# EAGLE schematic oresat0-1u-backplane (EAGLE 9.6.2)

## Sheet 1 of 9: Slot 1
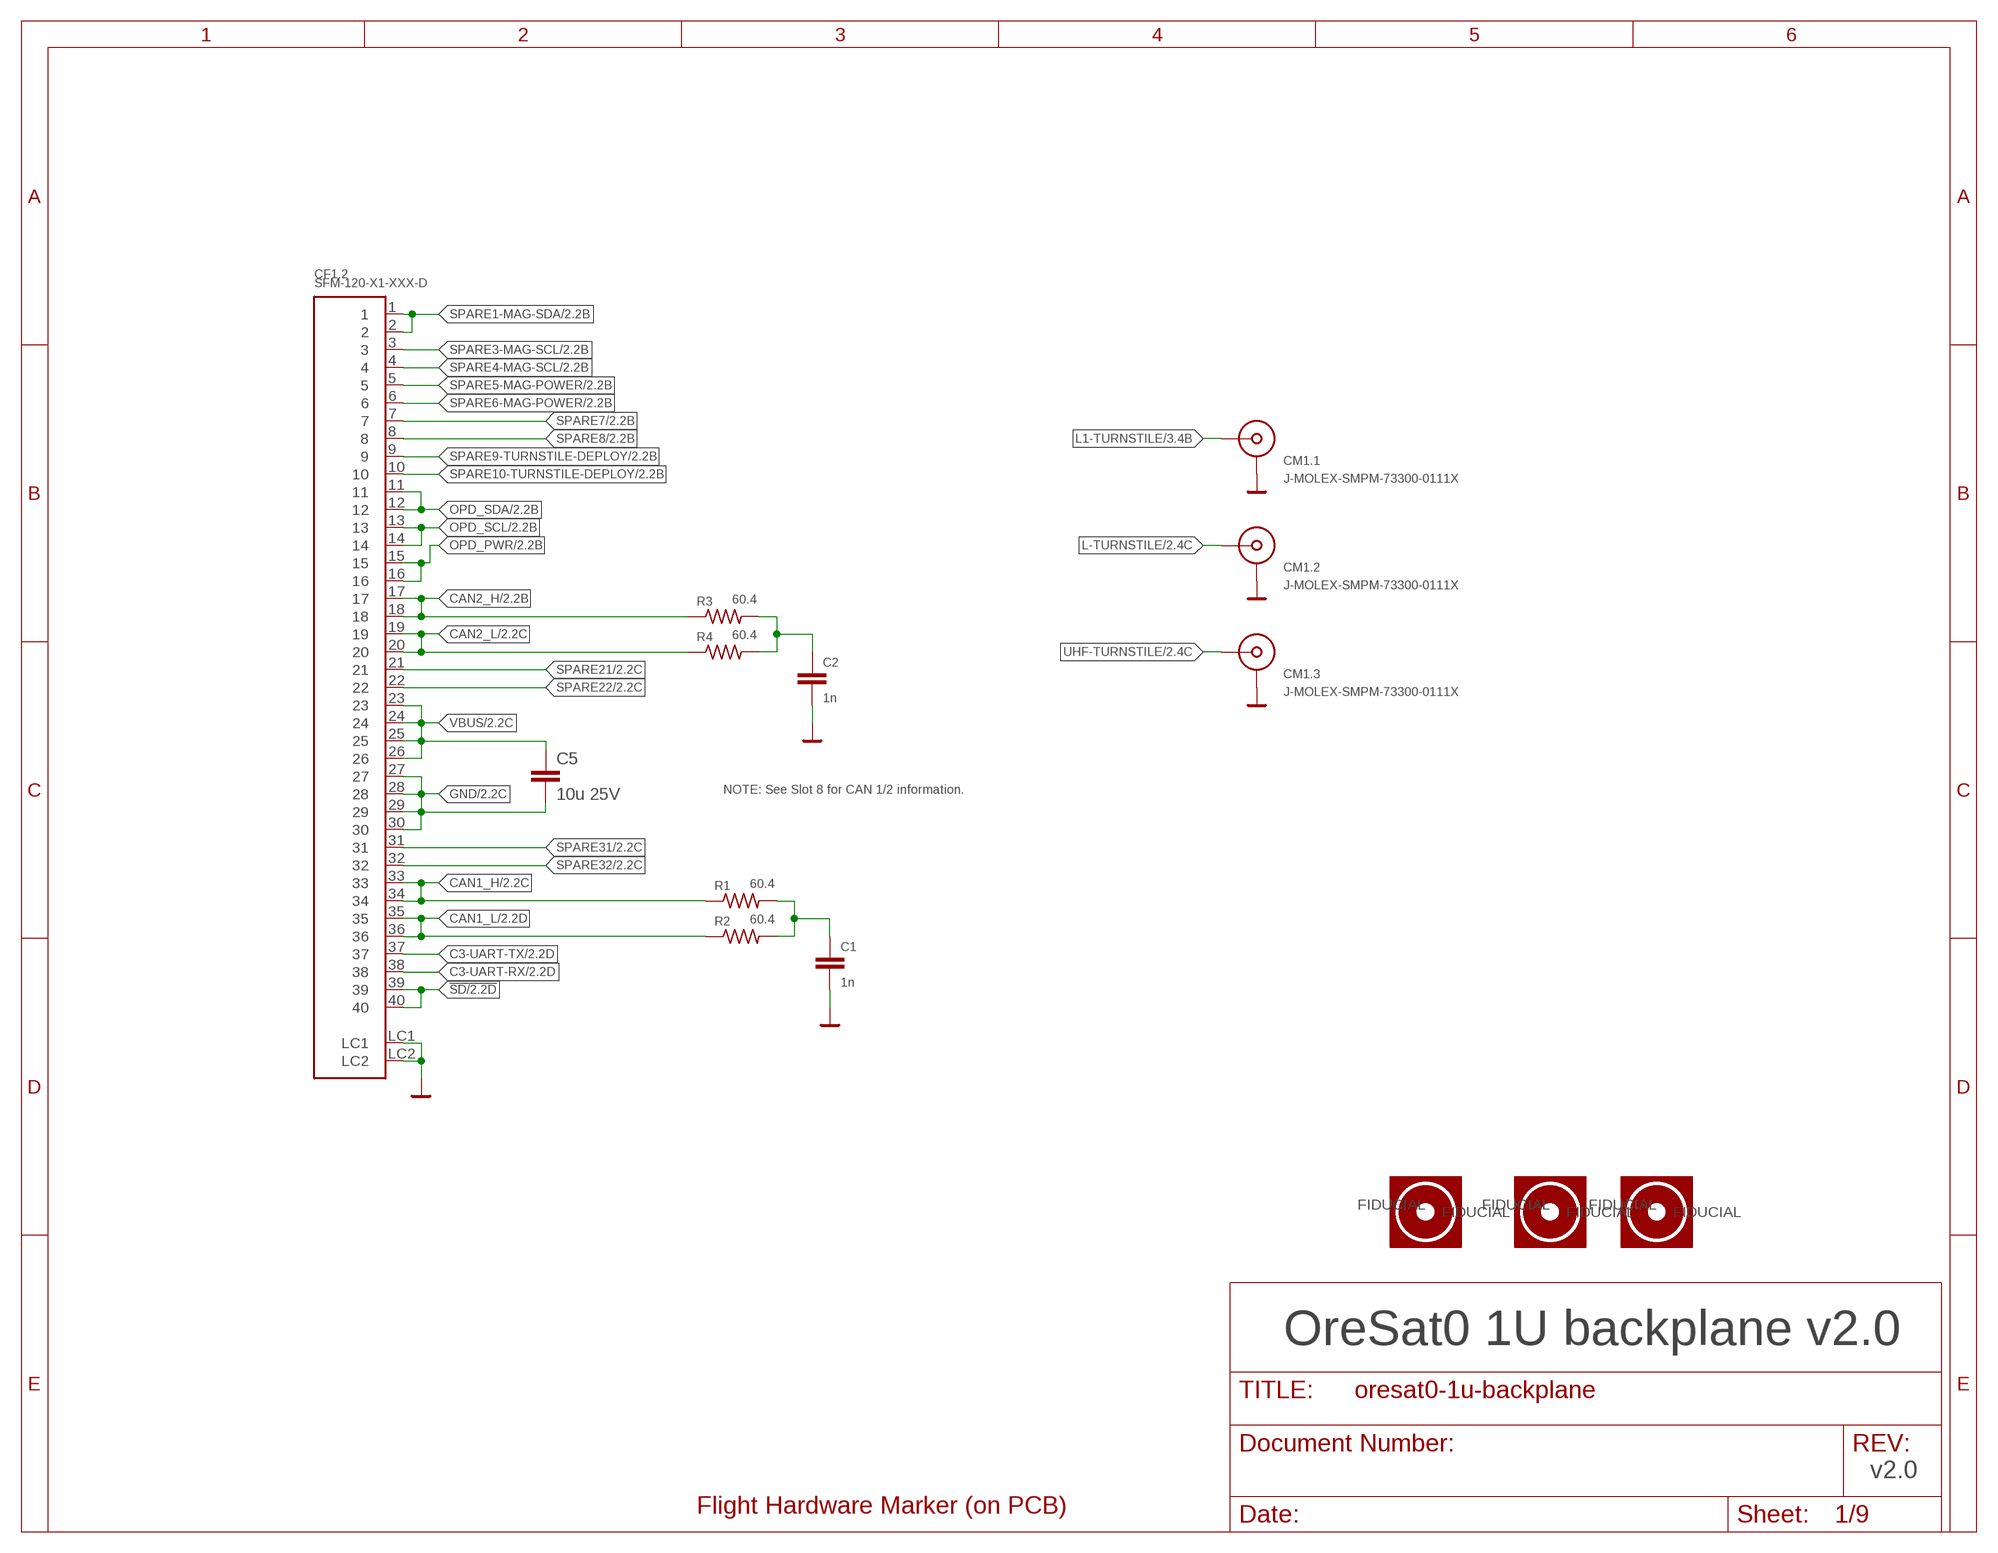
[diagram p0: schematic, sheet 1]

### Parts
C1  1n  C-EU0603-C-NOSILK  [.0603-C-NOSILK]
C2  1n  C-EU0603-C-NOSILK  [.0603-C-NOSILK]
C5  10u 25V  C-EU1206-B  [1206-B]
CF1.2  SFM-120-X1-XXX-D  [SFM-120-X1-XXX-D]
CM1.1  J-MOLEX-SMPM-73300-0111X  [J-MOLEX-SMPM-73300-0111X]
CM1.2  J-MOLEX-SMPM-73300-0111X  [J-MOLEX-SMPM-73300-0111X]
CM1.3  J-MOLEX-SMPM-73300-0111X  [J-MOLEX-SMPM-73300-0111X]
FIDUCIAL1  FIDUCIAL-1.0X2.0  [FIDUCIAL-1.0X2.0]
FIDUCIAL2  FIDUCIAL-1.0X2.0  [FIDUCIAL-1.0X2.0]
FIDUCIAL3  FIDUCIAL-1.0X2.0  [FIDUCIAL-1.0X2.0]
R1  60.4  R-US_1206-C  [1206-C]
R2  60.4  R-US_1206-C  [1206-C]
R3  60.4  R-US_1206-C  [1206-C]
R4  60.4  R-US_1206-C  [1206-C]
U$1  FLIGHMARKERNEW  [FLIGHTMARKER_NEW_BOARDS]

### Nets
!SD [SHUTDOWN]: CF1.2.39 CF1.2.40 ; also sheet 2,3,4,5,6,7
C3-UART-RX: CF1.2.38 ; also sheet 2,3,4,5,6,7
C3-UART-TX: CF1.2.37 ; also sheet 2,3,4,5,6,7
CAN1_H: CF1.2.33 CF1.2.34 R1.1 ; also sheet 2,3,4,5,6,7,8
CAN1_L: CF1.2.35 CF1.2.36 R2.1 ; also sheet 2,3,4,5,6,7,8
CAN2_H: CF1.2.17 CF1.2.18 R3.1 ; also sheet 2,3,4,5,6,7,8
CAN2_L: CF1.2.19 CF1.2.20 R4.1 ; also sheet 2,3,4,5,6,7,8
GND: C1.2 C2.2 C5.2 CF1.2.27 CF1.2.28 CF1.2.29 CF1.2.30 CF1.2.LC1 CF1.2.LC2 CM1.1.P$1(SHIELD1) CM1.1.P$2(SHIELD1) CM1.1.P$3(SHIELD1) CM1.1.P$4(SHIELD1) CM1.2.P$1(SHIELD1) CM1.2.P$2(SHIELD1) CM1.2.P$3(SHIELD1) CM1.2.P$4(SHIELD1) CM1.3.P$1(SHIELD1) CM1.3.P$2(SHIELD1) CM1.3.P$3(SHIELD1) CM1.3.P$4(SHIELD1) ; also sheet 2,3,4,5,6,7,8,9
L1-TURNSTILE [RF]: CM1.1.RF-DOWN(RF) ; also sheet 3
L-TURNSTILE [RF]: CM1.2.RF-DOWN(RF) ; also sheet 2
N$1: C2.1 R3.2 R4.2
N$2: C1.1 R1.2 R2.2
OPD_PWR: CF1.2.15 CF1.2.16 ; also sheet 2,3,4,5,6,7
OPD_SCL: CF1.2.13 CF1.2.14 ; also sheet 2,3,4,5,6,7
OPD_SDA: CF1.2.11 CF1.2.12 ; also sheet 2,3,4,5,6,7
SPARE1-MAG-SDA: CF1.2.1 CF1.2.2 ; also sheet 2,3,4,5,6,7,9
SPARE3-MAG-SCL: CF1.2.3 ; also sheet 2,3,4,5,6,7,9
SPARE4-MAG-SCL: CF1.2.4 ; also sheet 2,3,4,5,6,7,9
SPARE5-MAG-POWER: CF1.2.5 ; also sheet 2,3,4,5,6,7,9
SPARE6-MAG-POWER: CF1.2.6 ; also sheet 2,3,4,5,6,7,9
SPARE7: CF1.2.7 ; also sheet 2,3,4,5,6,7,9
SPARE8: CF1.2.8 ; also sheet 2,3,4,5,6,7,9
SPARE9-TURNSTILE-DEPLOY: CF1.2.9 ; also sheet 2,3,4,5,6,7,9
SPARE10-TURNSTILE-DEPLOY: CF1.2.10 ; also sheet 2,3,4,5,6,7,9
SPARE21: CF1.2.21 ; also sheet 2,3,4,5,6,7
SPARE22: CF1.2.22 ; also sheet 2,3,4,5,6,7
SPARE31: CF1.2.31 ; also sheet 2,3,4,5,6,7
SPARE32: CF1.2.32 ; also sheet 2,3,4,5,6,7
UHF-TURNSTILE [RF]: CM1.3.RF-DOWN(RF) ; also sheet 2
VBUS: C5.1 CF1.2.23 CF1.2.24 CF1.2.25 CF1.2.26 ; also sheet 2,3,4,5,6,7
Unconnected: FIDUCIAL1.FIDUCIAL FIDUCIAL2.FIDUCIAL FIDUCIAL3.FIDUCIAL

### Notes on the sheet
- NOTE: See Slot 8 for CAN 1/2 information.
- OreSat0 1U backplane v2.0
- v2.0

## Sheet 2 of 9: Slot 2
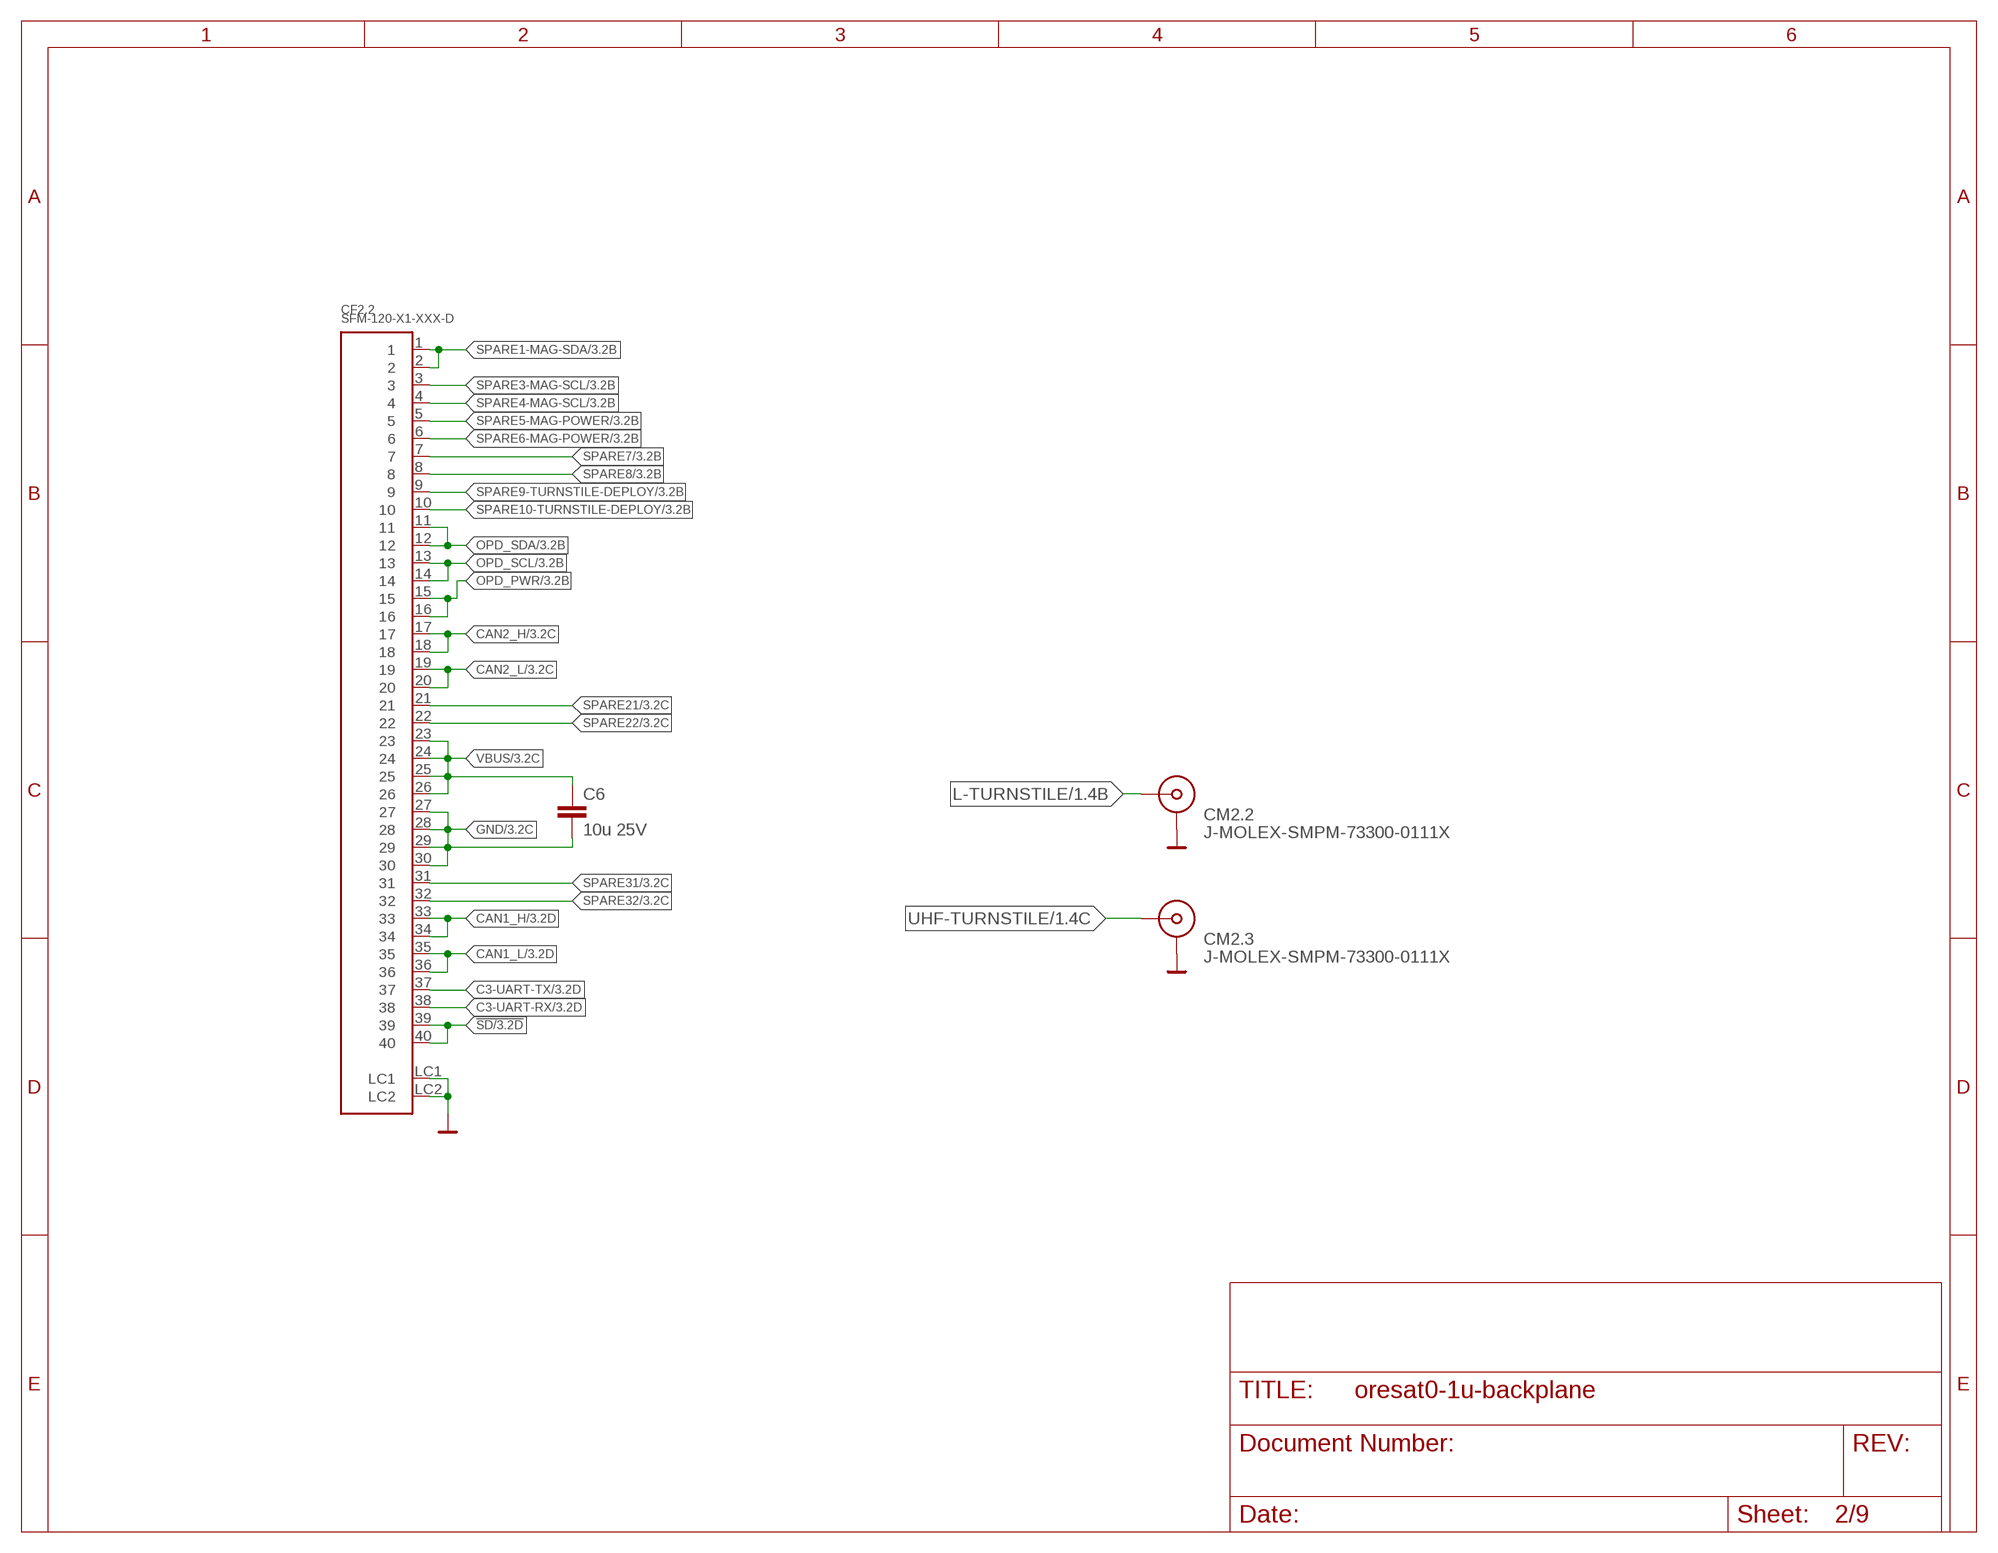
[diagram p1: schematic, sheet 2]

### Parts
C6  10u 25V  C-EU1206-B  [1206-B]
CF2.2  SFM-120-X1-XXX-D  [SFM-120-X1-XXX-D]
CM2.2  J-MOLEX-SMPM-73300-0111X  [J-MOLEX-SMPM-73300-0111X]
CM2.3  J-MOLEX-SMPM-73300-0111X  [J-MOLEX-SMPM-73300-0111X]

### Nets
!SD [SHUTDOWN]: CF2.2.39 CF2.2.40 ; also sheet 1,3,4,5,6,7
C3-UART-RX: CF2.2.38 ; also sheet 1,3,4,5,6,7
C3-UART-TX: CF2.2.37 ; also sheet 1,3,4,5,6,7
CAN1_H: CF2.2.33 CF2.2.34 ; also sheet 1,3,4,5,6,7,8
CAN1_L: CF2.2.35 CF2.2.36 ; also sheet 1,3,4,5,6,7,8
CAN2_H: CF2.2.17 CF2.2.18 ; also sheet 1,3,4,5,6,7,8
CAN2_L: CF2.2.19 CF2.2.20 ; also sheet 1,3,4,5,6,7,8
GND: C6.2 CF2.2.27 CF2.2.28 CF2.2.29 CF2.2.30 CF2.2.LC1 CF2.2.LC2 CM2.2.P$1(SHIELD1) CM2.2.P$2(SHIELD1) CM2.2.P$3(SHIELD1) CM2.2.P$4(SHIELD1) CM2.3.P$1(SHIELD1) CM2.3.P$2(SHIELD1) CM2.3.P$3(SHIELD1) CM2.3.P$4(SHIELD1) ; also sheet 1,3,4,5,6,7,8,9
L-TURNSTILE [RF]: CM2.2.RF-DOWN(RF) ; also sheet 1
OPD_PWR: CF2.2.15 CF2.2.16 ; also sheet 1,3,4,5,6,7
OPD_SCL: CF2.2.13 CF2.2.14 ; also sheet 1,3,4,5,6,7
OPD_SDA: CF2.2.11 CF2.2.12 ; also sheet 1,3,4,5,6,7
SPARE1-MAG-SDA: CF2.2.1 CF2.2.2 ; also sheet 1,3,4,5,6,7,9
SPARE3-MAG-SCL: CF2.2.3 ; also sheet 1,3,4,5,6,7,9
SPARE4-MAG-SCL: CF2.2.4 ; also sheet 1,3,4,5,6,7,9
SPARE5-MAG-POWER: CF2.2.5 ; also sheet 1,3,4,5,6,7,9
SPARE6-MAG-POWER: CF2.2.6 ; also sheet 1,3,4,5,6,7,9
SPARE7: CF2.2.7 ; also sheet 1,3,4,5,6,7,9
SPARE8: CF2.2.8 ; also sheet 1,3,4,5,6,7,9
SPARE9-TURNSTILE-DEPLOY: CF2.2.9 ; also sheet 1,3,4,5,6,7,9
SPARE10-TURNSTILE-DEPLOY: CF2.2.10 ; also sheet 1,3,4,5,6,7,9
SPARE21: CF2.2.21 ; also sheet 1,3,4,5,6,7
SPARE22: CF2.2.22 ; also sheet 1,3,4,5,6,7
SPARE31: CF2.2.31 ; also sheet 1,3,4,5,6,7
SPARE32: CF2.2.32 ; also sheet 1,3,4,5,6,7
UHF-TURNSTILE [RF]: CM2.3.RF-DOWN(RF) ; also sheet 1
VBUS: C6.1 CF2.2.23 CF2.2.24 CF2.2.25 CF2.2.26 ; also sheet 1,3,4,5,6,7

## Sheet 3 of 9: Slot 3
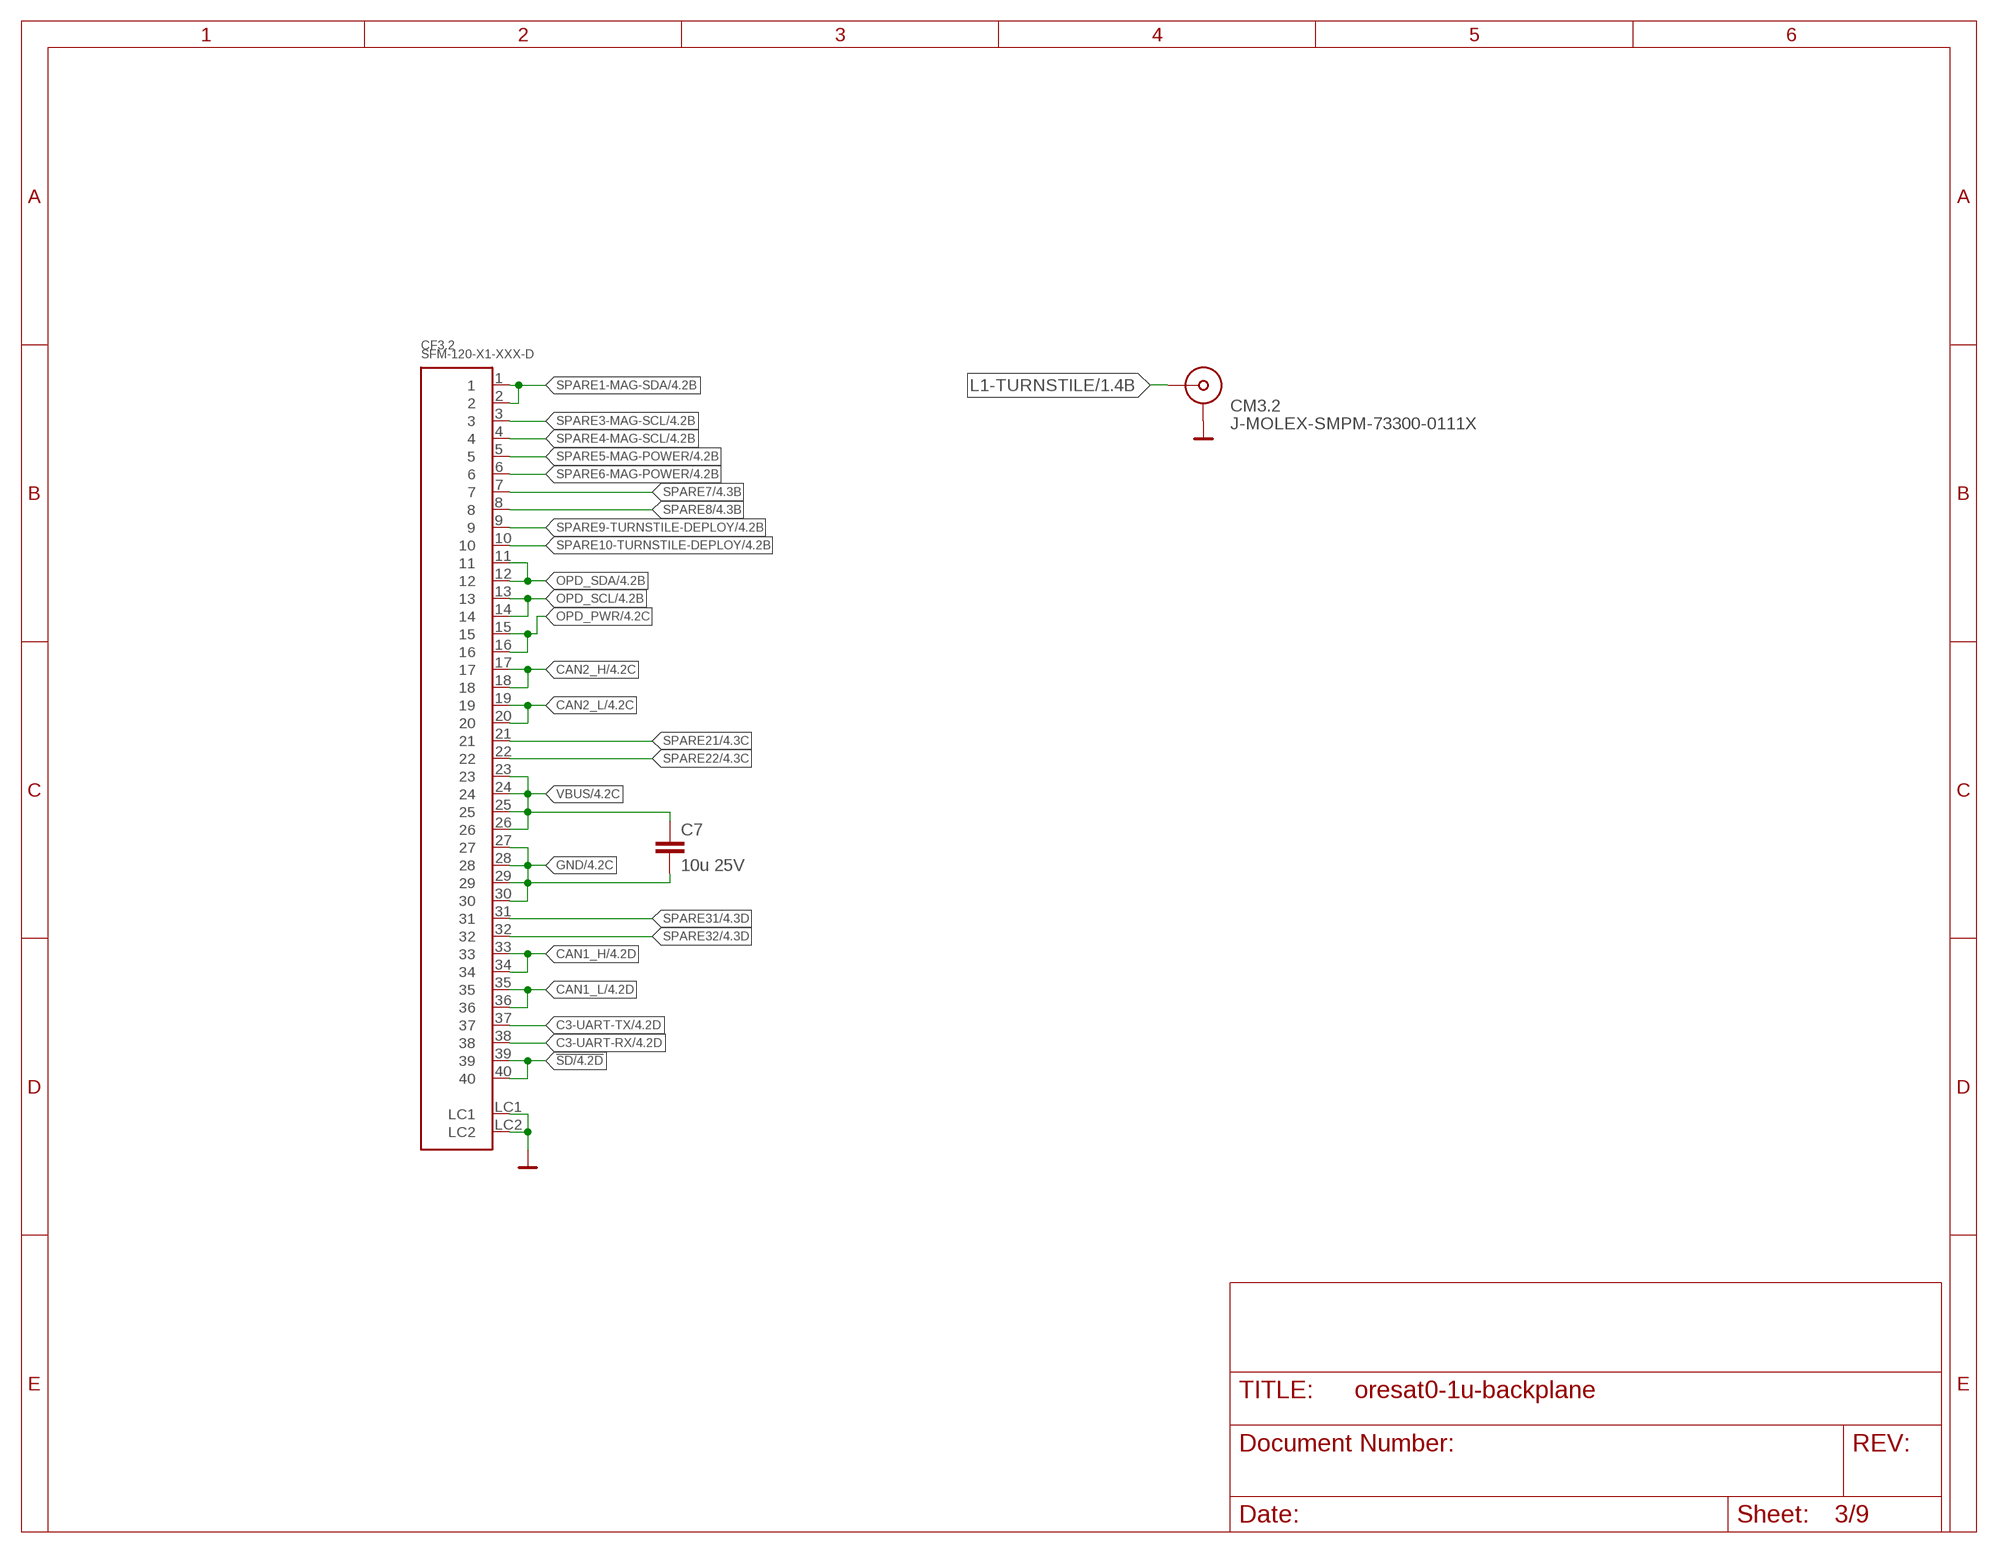
[diagram p2: schematic, sheet 3]

### Parts
C7  10u 25V  C-EU1206-B  [1206-B]
CF3.2  SFM-120-X1-XXX-D  [SFM-120-X1-XXX-D]
CM3.2  J-MOLEX-SMPM-73300-0111X  [J-MOLEX-SMPM-73300-0111X]

### Nets
!SD [SHUTDOWN]: CF3.2.39 CF3.2.40 ; also sheet 1,2,4,5,6,7
C3-UART-RX: CF3.2.38 ; also sheet 1,2,4,5,6,7
C3-UART-TX: CF3.2.37 ; also sheet 1,2,4,5,6,7
CAN1_H: CF3.2.33 CF3.2.34 ; also sheet 1,2,4,5,6,7,8
CAN1_L: CF3.2.35 CF3.2.36 ; also sheet 1,2,4,5,6,7,8
CAN2_H: CF3.2.17 CF3.2.18 ; also sheet 1,2,4,5,6,7,8
CAN2_L: CF3.2.19 CF3.2.20 ; also sheet 1,2,4,5,6,7,8
GND: C7.2 CF3.2.27 CF3.2.28 CF3.2.29 CF3.2.30 CF3.2.LC1 CF3.2.LC2 CM3.2.P$1(SHIELD1) CM3.2.P$2(SHIELD1) CM3.2.P$3(SHIELD1) CM3.2.P$4(SHIELD1) ; also sheet 1,2,4,5,6,7,8,9
L1-TURNSTILE [RF]: CM3.2.RF-DOWN(RF) ; also sheet 1
OPD_PWR: CF3.2.15 CF3.2.16 ; also sheet 1,2,4,5,6,7
OPD_SCL: CF3.2.13 CF3.2.14 ; also sheet 1,2,4,5,6,7
OPD_SDA: CF3.2.11 CF3.2.12 ; also sheet 1,2,4,5,6,7
SPARE1-MAG-SDA: CF3.2.1 CF3.2.2 ; also sheet 1,2,4,5,6,7,9
SPARE3-MAG-SCL: CF3.2.3 ; also sheet 1,2,4,5,6,7,9
SPARE4-MAG-SCL: CF3.2.4 ; also sheet 1,2,4,5,6,7,9
SPARE5-MAG-POWER: CF3.2.5 ; also sheet 1,2,4,5,6,7,9
SPARE6-MAG-POWER: CF3.2.6 ; also sheet 1,2,4,5,6,7,9
SPARE7: CF3.2.7 ; also sheet 1,2,4,5,6,7,9
SPARE8: CF3.2.8 ; also sheet 1,2,4,5,6,7,9
SPARE9-TURNSTILE-DEPLOY: CF3.2.9 ; also sheet 1,2,4,5,6,7,9
SPARE10-TURNSTILE-DEPLOY: CF3.2.10 ; also sheet 1,2,4,5,6,7,9
SPARE21: CF3.2.21 ; also sheet 1,2,4,5,6,7
SPARE22: CF3.2.22 ; also sheet 1,2,4,5,6,7
SPARE31: CF3.2.31 ; also sheet 1,2,4,5,6,7
SPARE32: CF3.2.32 ; also sheet 1,2,4,5,6,7
VBUS: C7.1 CF3.2.23 CF3.2.24 CF3.2.25 CF3.2.26 ; also sheet 1,2,4,5,6,7

## Sheet 4 of 9: Slot 4
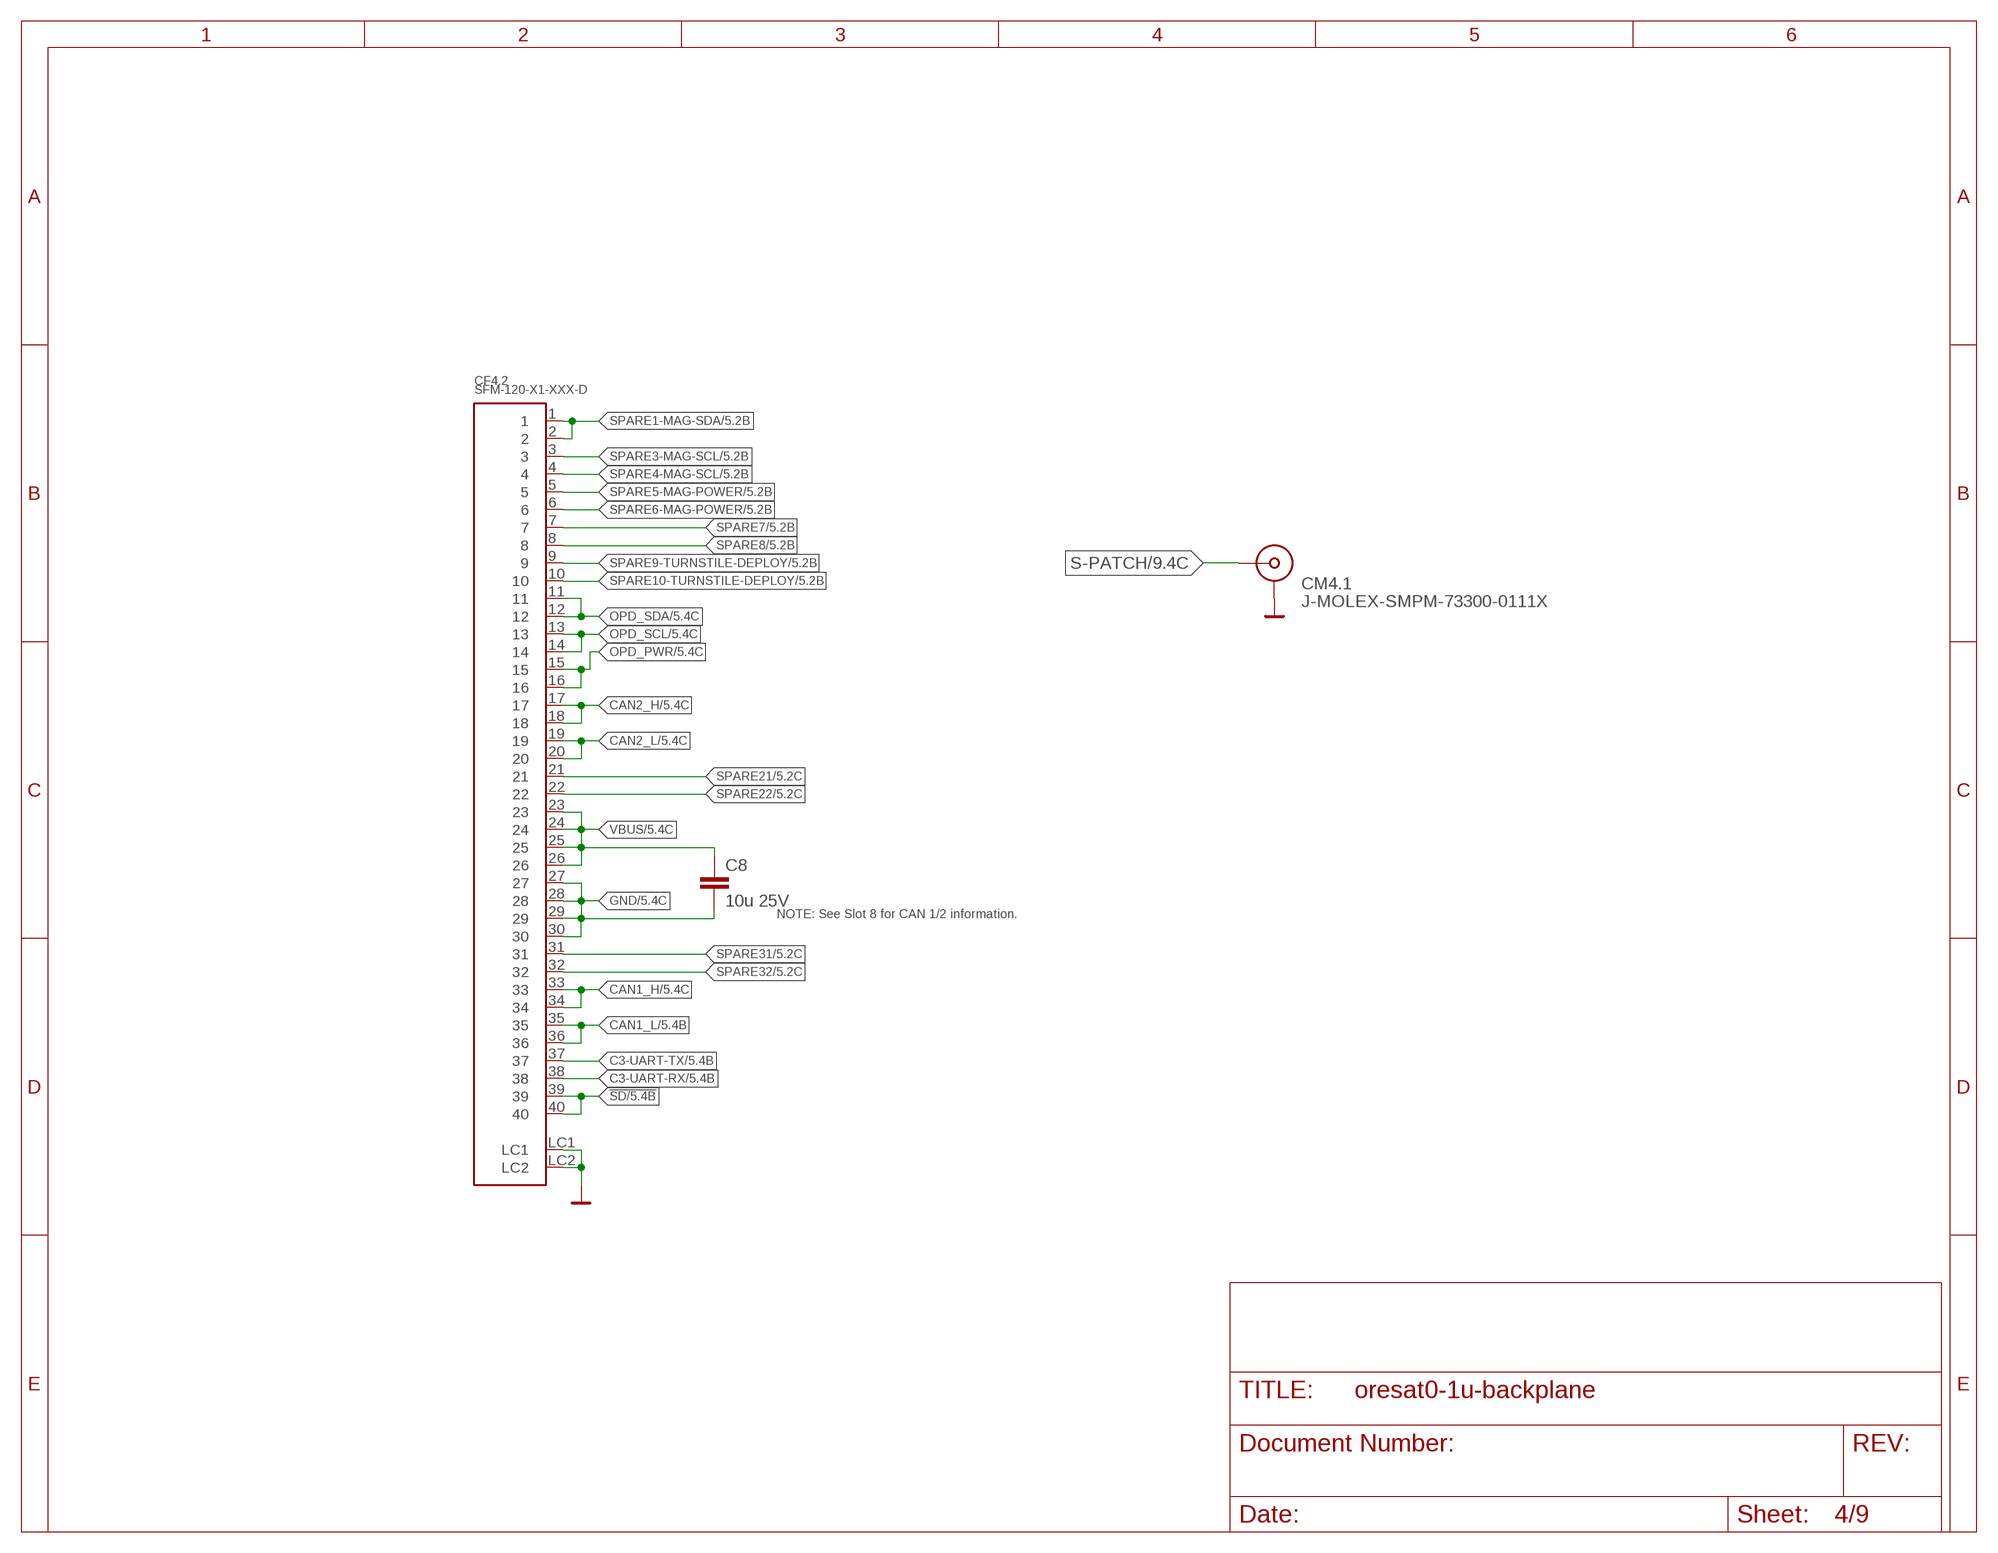
[diagram p3: schematic, sheet 4]

### Parts
C8  10u 25V  C-EU1206-B  [1206-B]
CF4.2  SFM-120-X1-XXX-D  [SFM-120-X1-XXX-D]
CM4.1  J-MOLEX-SMPM-73300-0111X  [J-MOLEX-SMPM-73300-0111X]

### Nets
!SD [SHUTDOWN]: CF4.2.39 CF4.2.40 ; also sheet 1,2,3,5,6,7
C3-UART-RX: CF4.2.38 ; also sheet 1,2,3,5,6,7
C3-UART-TX: CF4.2.37 ; also sheet 1,2,3,5,6,7
CAN1_H: CF4.2.33 CF4.2.34 ; also sheet 1,2,3,5,6,7,8
CAN1_L: CF4.2.35 CF4.2.36 ; also sheet 1,2,3,5,6,7,8
CAN2_H: CF4.2.17 CF4.2.18 ; also sheet 1,2,3,5,6,7,8
CAN2_L: CF4.2.19 CF4.2.20 ; also sheet 1,2,3,5,6,7,8
GND: C8.2 CF4.2.27 CF4.2.28 CF4.2.29 CF4.2.30 CF4.2.LC1 CF4.2.LC2 CM4.1.P$1(SHIELD1) CM4.1.P$2(SHIELD1) CM4.1.P$3(SHIELD1) CM4.1.P$4(SHIELD1) ; also sheet 1,2,3,5,6,7,8,9
OPD_PWR: CF4.2.15 CF4.2.16 ; also sheet 1,2,3,5,6,7
OPD_SCL: CF4.2.13 CF4.2.14 ; also sheet 1,2,3,5,6,7
OPD_SDA: CF4.2.11 CF4.2.12 ; also sheet 1,2,3,5,6,7
S-PATCH [RF]: CM4.1.RF-DOWN(RF) ; also sheet 9
SPARE1-MAG-SDA: CF4.2.1 CF4.2.2 ; also sheet 1,2,3,5,6,7,9
SPARE3-MAG-SCL: CF4.2.3 ; also sheet 1,2,3,5,6,7,9
SPARE4-MAG-SCL: CF4.2.4 ; also sheet 1,2,3,5,6,7,9
SPARE5-MAG-POWER: CF4.2.5 ; also sheet 1,2,3,5,6,7,9
SPARE6-MAG-POWER: CF4.2.6 ; also sheet 1,2,3,5,6,7,9
SPARE7: CF4.2.7 ; also sheet 1,2,3,5,6,7,9
SPARE8: CF4.2.8 ; also sheet 1,2,3,5,6,7,9
SPARE9-TURNSTILE-DEPLOY: CF4.2.9 ; also sheet 1,2,3,5,6,7,9
SPARE10-TURNSTILE-DEPLOY: CF4.2.10 ; also sheet 1,2,3,5,6,7,9
SPARE21: CF4.2.21 ; also sheet 1,2,3,5,6,7
SPARE22: CF4.2.22 ; also sheet 1,2,3,5,6,7
SPARE31: CF4.2.31 ; also sheet 1,2,3,5,6,7
SPARE32: CF4.2.32 ; also sheet 1,2,3,5,6,7
VBUS: C8.1 CF4.2.23 CF4.2.24 CF4.2.25 CF4.2.26 ; also sheet 1,2,3,5,6,7

### Notes on the sheet
- NOTE: See Slot 8 for CAN 1/2 information.

## Sheet 5 of 9: Slot 5
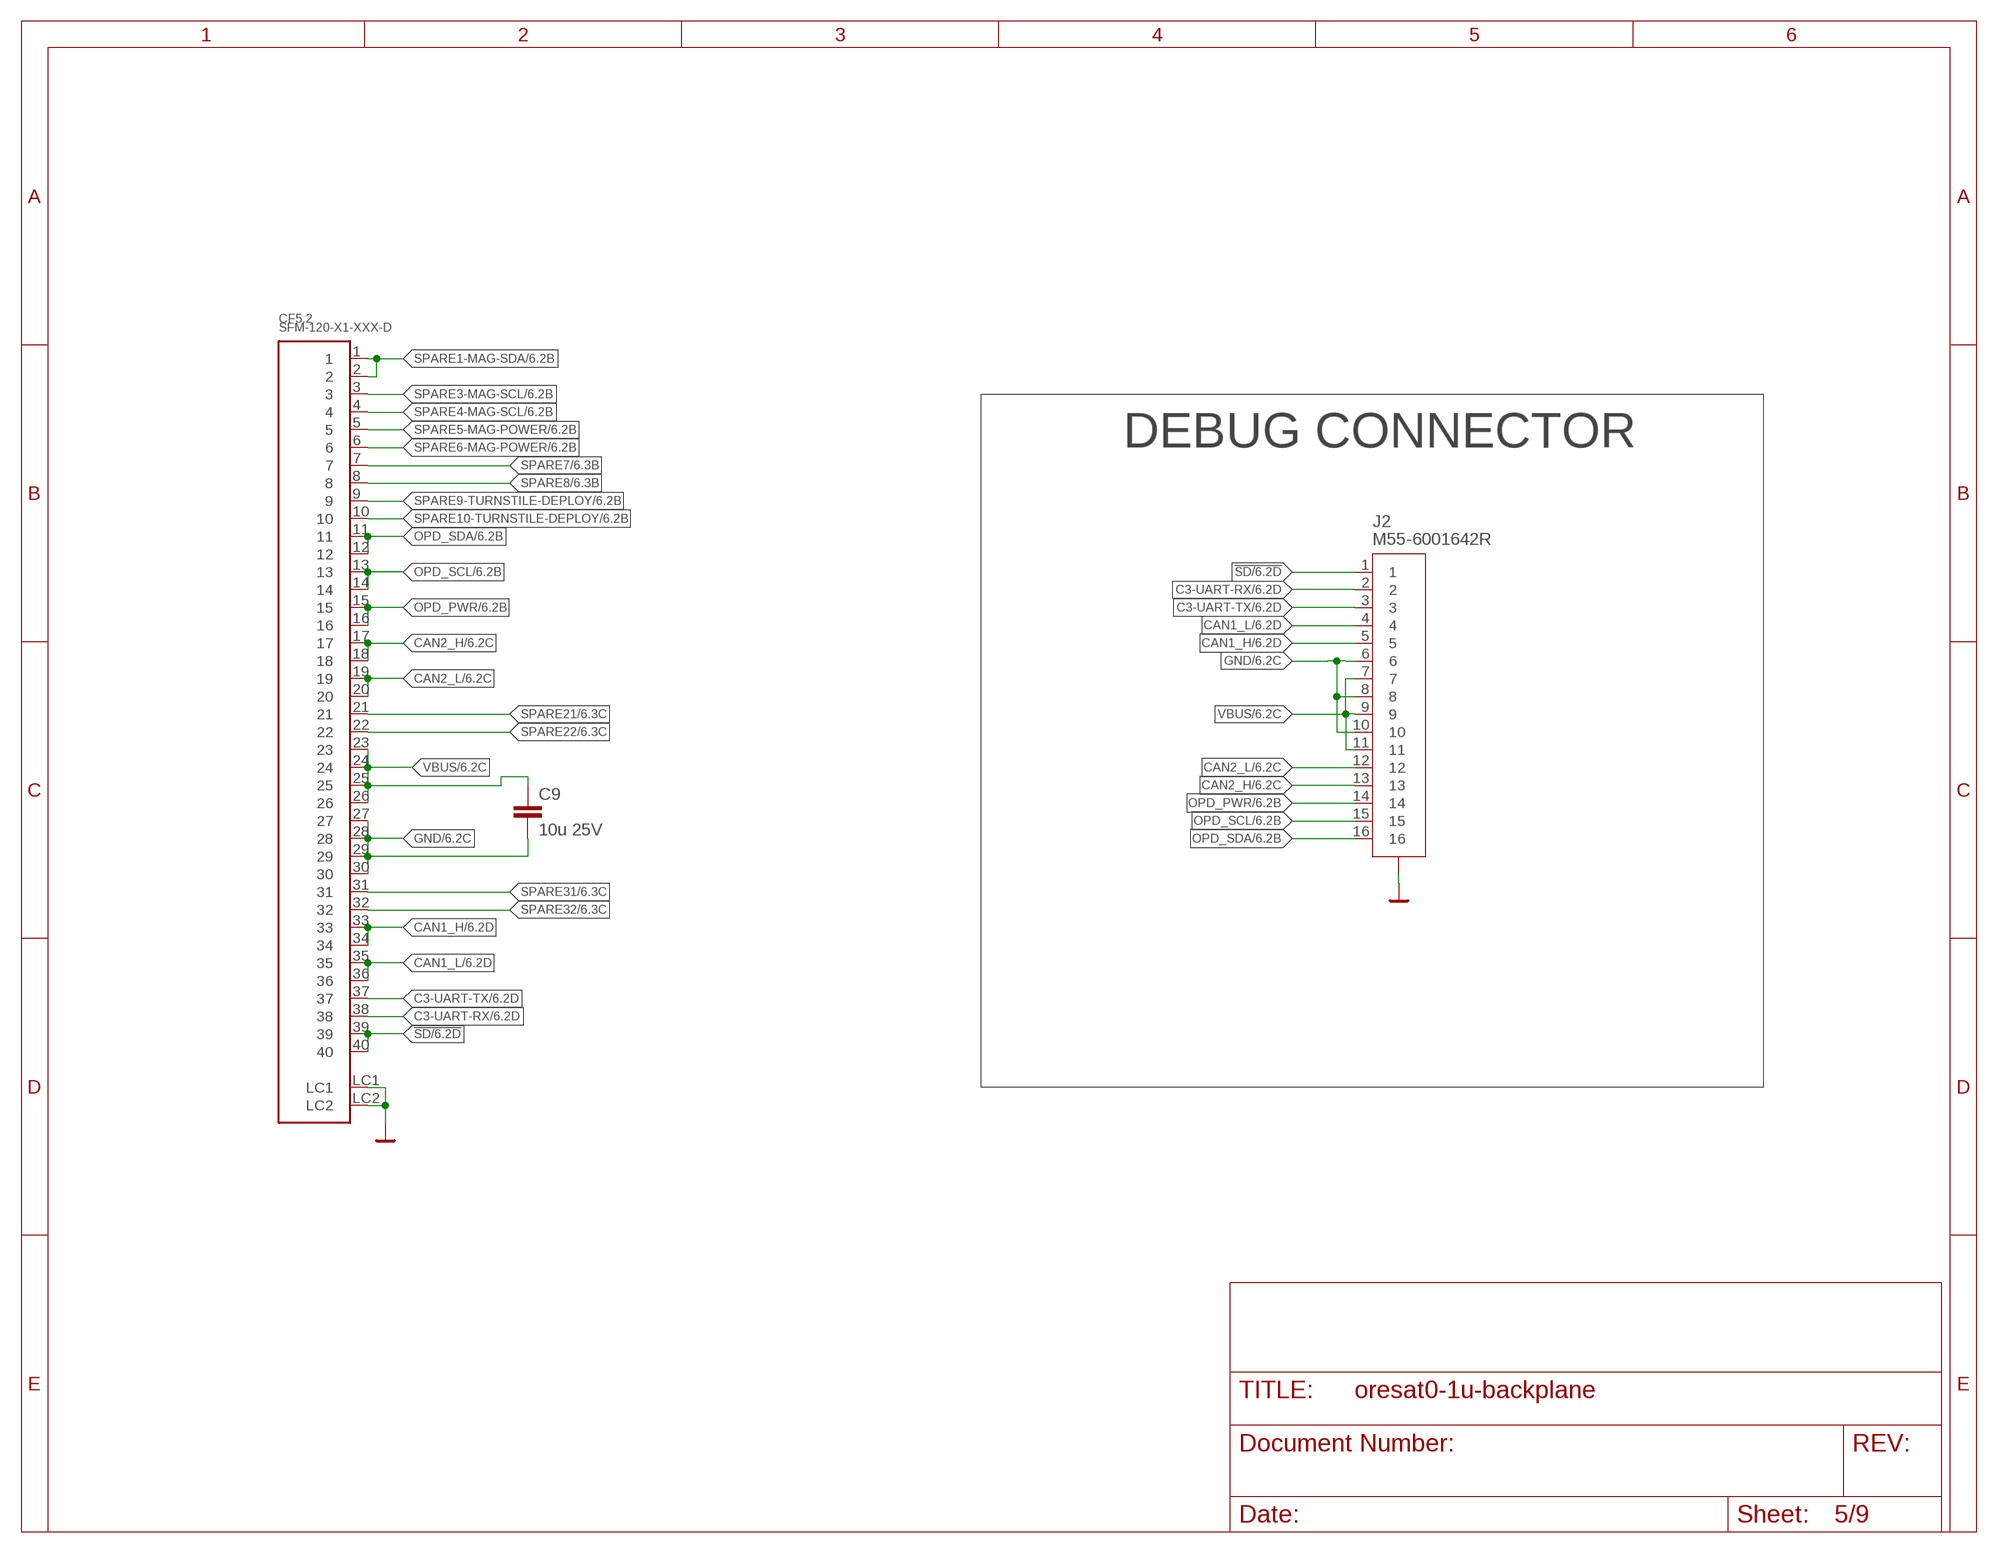
[diagram p4: schematic, sheet 5]

### Parts
C9  10u 25V  C-EU1206-B  [1206-B]
CF5.2  SFM-120-X1-XXX-D  [SFM-120-X1-XXX-D]
J2  M55-6001642R  [CONN_M55-6001642R_HRW]

### Nets
!SD [SHUTDOWN]: CF5.2.39 CF5.2.40 J2.1 ; also sheet 1,2,3,4,6,7
C3-UART-RX: CF5.2.38 J2.2 ; also sheet 1,2,3,4,6,7
C3-UART-TX: CF5.2.37 J2.3 ; also sheet 1,2,3,4,6,7
CAN1_H: CF5.2.33 CF5.2.34 J2.5 ; also sheet 1,2,3,4,6,7,8
CAN1_L: CF5.2.35 CF5.2.36 J2.4 ; also sheet 1,2,3,4,6,7,8
CAN2_H: CF5.2.17 CF5.2.18 J2.13 ; also sheet 1,2,3,4,6,7,8
CAN2_L: CF5.2.19 CF5.2.20 J2.12 ; also sheet 1,2,3,4,6,7,8
GND: C9.2 CF5.2.27 CF5.2.28 CF5.2.29 CF5.2.30 CF5.2.LC1 CF5.2.LC2 J2.6 J2.8 J2.10 J2.19 J2.20 J2.21 J2.22 ; also sheet 1,2,3,4,6,7,8,9
OPD_PWR: CF5.2.15 CF5.2.16 J2.14 ; also sheet 1,2,3,4,6,7
OPD_SCL: CF5.2.13 CF5.2.14 J2.15 ; also sheet 1,2,3,4,6,7
OPD_SDA: CF5.2.11 CF5.2.12 J2.16 ; also sheet 1,2,3,4,6,7
SPARE1-MAG-SDA: CF5.2.1 CF5.2.2 ; also sheet 1,2,3,4,6,7,9
SPARE3-MAG-SCL: CF5.2.3 ; also sheet 1,2,3,4,6,7,9
SPARE4-MAG-SCL: CF5.2.4 ; also sheet 1,2,3,4,6,7,9
SPARE5-MAG-POWER: CF5.2.5 ; also sheet 1,2,3,4,6,7,9
SPARE6-MAG-POWER: CF5.2.6 ; also sheet 1,2,3,4,6,7,9
SPARE7: CF5.2.7 ; also sheet 1,2,3,4,6,7,9
SPARE8: CF5.2.8 ; also sheet 1,2,3,4,6,7,9
SPARE9-TURNSTILE-DEPLOY: CF5.2.9 ; also sheet 1,2,3,4,6,7,9
SPARE10-TURNSTILE-DEPLOY: CF5.2.10 ; also sheet 1,2,3,4,6,7,9
SPARE21: CF5.2.21 ; also sheet 1,2,3,4,6,7
SPARE22: CF5.2.22 ; also sheet 1,2,3,4,6,7
SPARE31: CF5.2.31 ; also sheet 1,2,3,4,6,7
SPARE32: CF5.2.32 ; also sheet 1,2,3,4,6,7
VBUS: C9.1 CF5.2.23 CF5.2.24 CF5.2.25 CF5.2.26 J2.7 J2.9 J2.11 ; also sheet 1,2,3,4,6,7

### Notes on the sheet
- DEBUG CONNECTOR

## Sheet 6 of 9: Slot 6
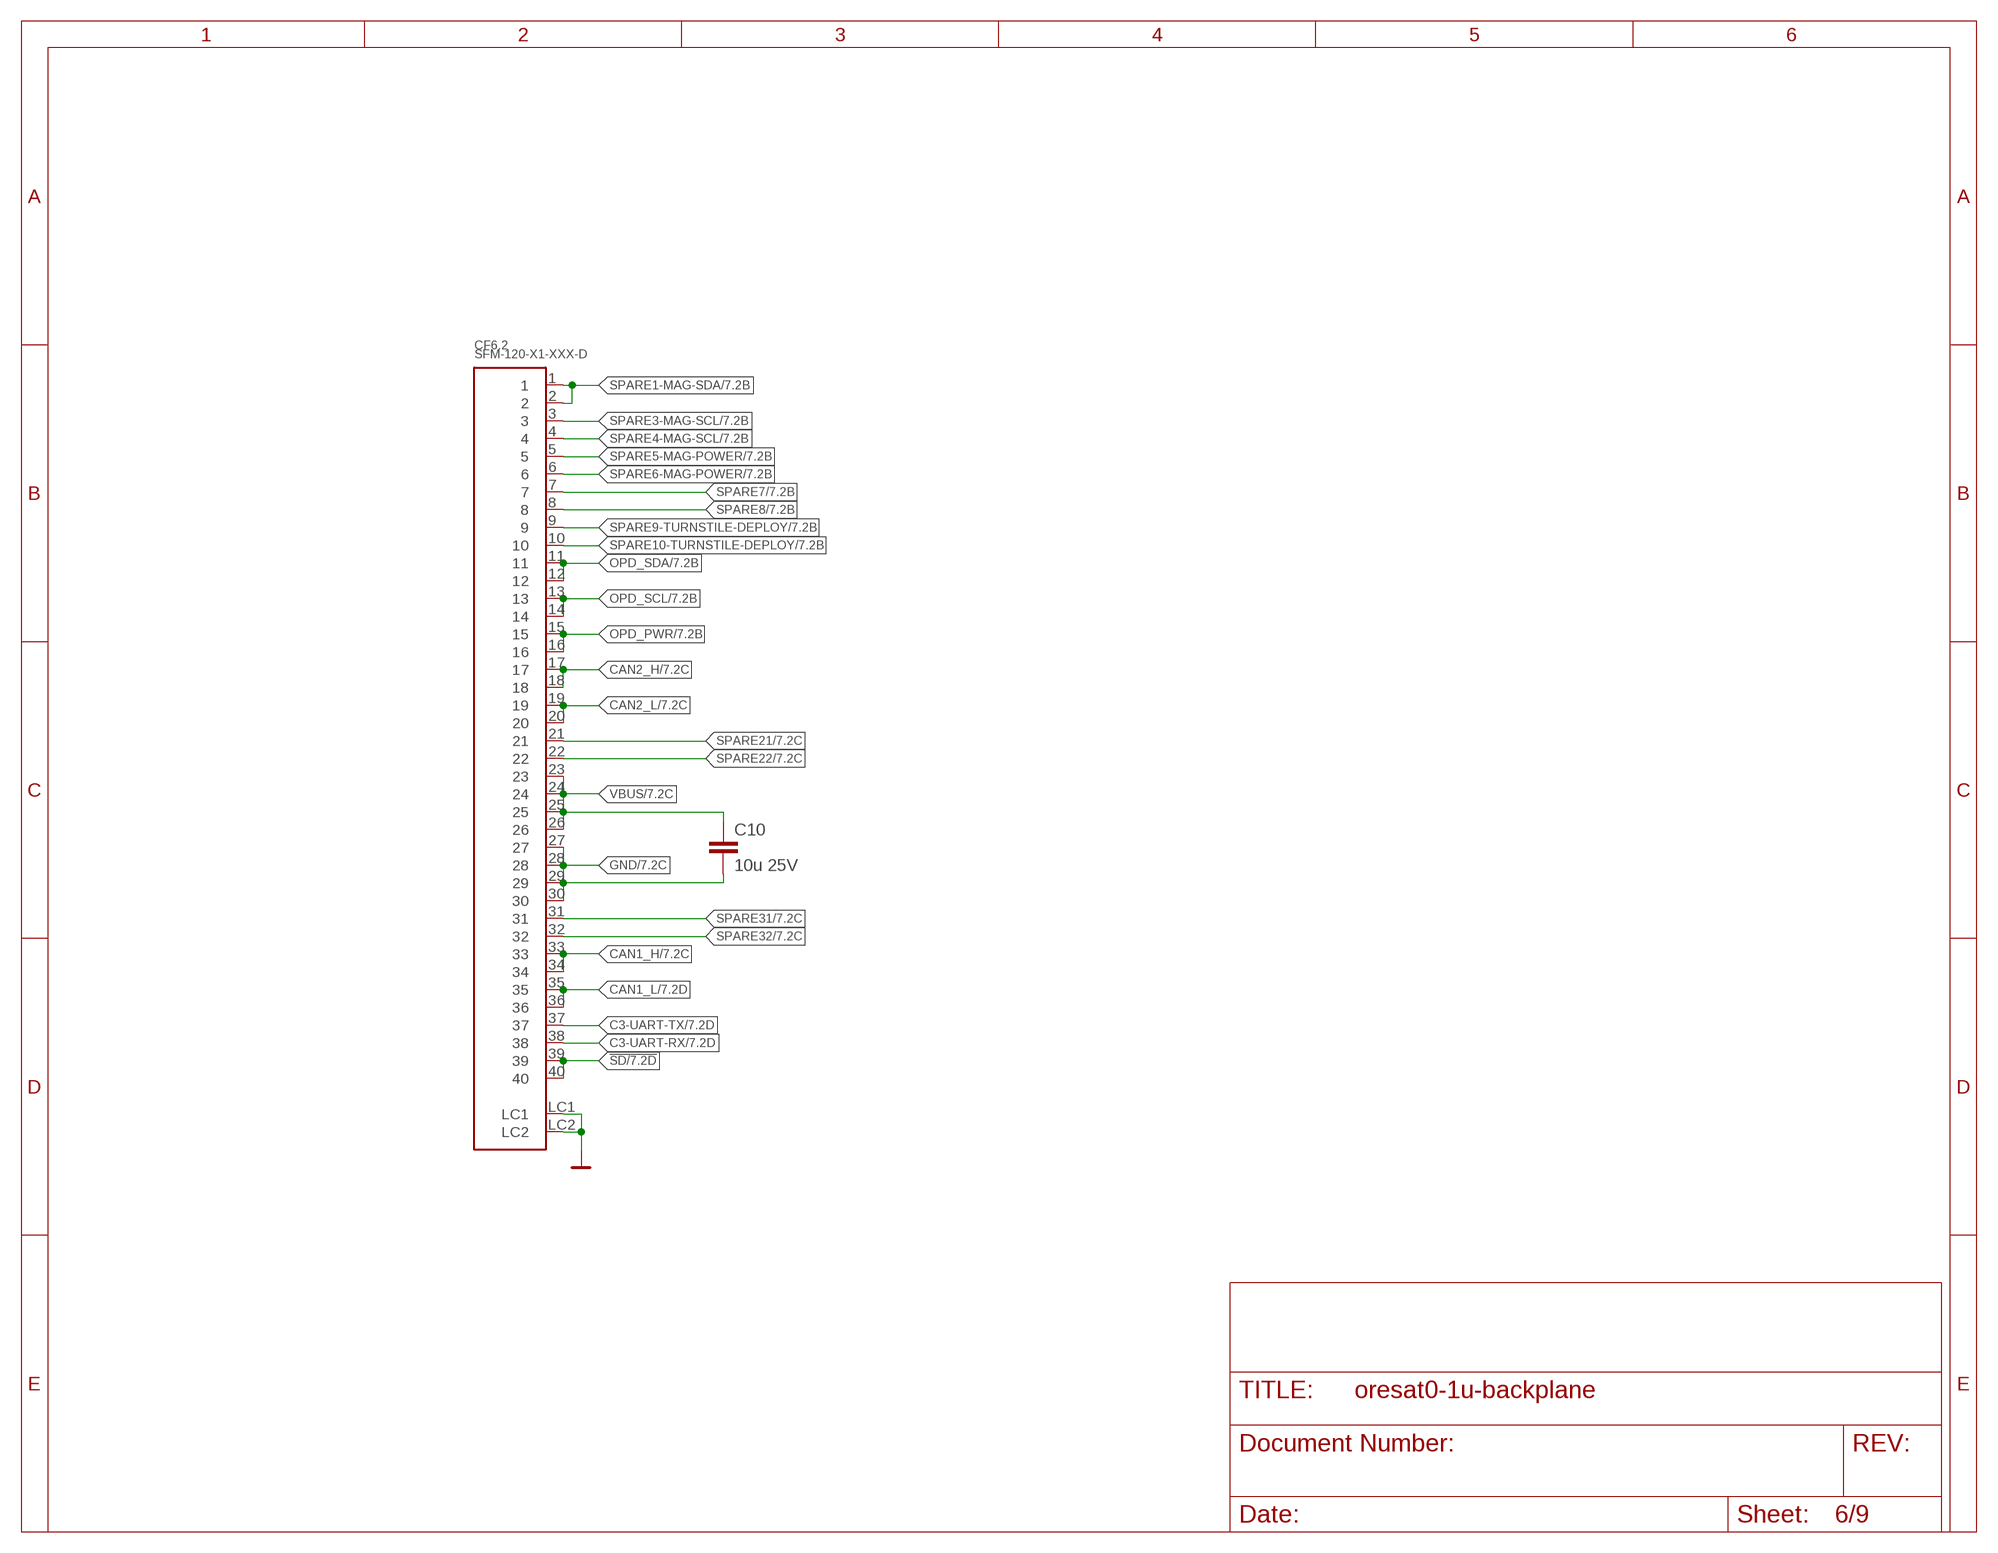
[diagram p5: schematic, sheet 6]

### Parts
C10  10u 25V  C-EU1206-B  [1206-B]
CF6.2  SFM-120-X1-XXX-D  [SFM-120-X1-XXX-D]

### Nets
!SD [SHUTDOWN]: CF6.2.39 CF6.2.40 ; also sheet 1,2,3,4,5,7
C3-UART-RX: CF6.2.38 ; also sheet 1,2,3,4,5,7
C3-UART-TX: CF6.2.37 ; also sheet 1,2,3,4,5,7
CAN1_H: CF6.2.33 CF6.2.34 ; also sheet 1,2,3,4,5,7,8
CAN1_L: CF6.2.35 CF6.2.36 ; also sheet 1,2,3,4,5,7,8
CAN2_H: CF6.2.17 CF6.2.18 ; also sheet 1,2,3,4,5,7,8
CAN2_L: CF6.2.19 CF6.2.20 ; also sheet 1,2,3,4,5,7,8
GND: C10.2 CF6.2.27 CF6.2.28 CF6.2.29 CF6.2.30 CF6.2.LC1 CF6.2.LC2 ; also sheet 1,2,3,4,5,7,8,9
OPD_PWR: CF6.2.15 CF6.2.16 ; also sheet 1,2,3,4,5,7
OPD_SCL: CF6.2.13 CF6.2.14 ; also sheet 1,2,3,4,5,7
OPD_SDA: CF6.2.11 CF6.2.12 ; also sheet 1,2,3,4,5,7
SPARE1-MAG-SDA: CF6.2.1 CF6.2.2 ; also sheet 1,2,3,4,5,7,9
SPARE3-MAG-SCL: CF6.2.3 ; also sheet 1,2,3,4,5,7,9
SPARE4-MAG-SCL: CF6.2.4 ; also sheet 1,2,3,4,5,7,9
SPARE5-MAG-POWER: CF6.2.5 ; also sheet 1,2,3,4,5,7,9
SPARE6-MAG-POWER: CF6.2.6 ; also sheet 1,2,3,4,5,7,9
SPARE7: CF6.2.7 ; also sheet 1,2,3,4,5,7,9
SPARE8: CF6.2.8 ; also sheet 1,2,3,4,5,7,9
SPARE9-TURNSTILE-DEPLOY: CF6.2.9 ; also sheet 1,2,3,4,5,7,9
SPARE10-TURNSTILE-DEPLOY: CF6.2.10 ; also sheet 1,2,3,4,5,7,9
SPARE21: CF6.2.21 ; also sheet 1,2,3,4,5,7
SPARE22: CF6.2.22 ; also sheet 1,2,3,4,5,7
SPARE31: CF6.2.31 ; also sheet 1,2,3,4,5,7
SPARE32: CF6.2.32 ; also sheet 1,2,3,4,5,7
VBUS: C10.1 CF6.2.23 CF6.2.24 CF6.2.25 CF6.2.26 ; also sheet 1,2,3,4,5,7

## Sheet 7 of 9: Slot 7
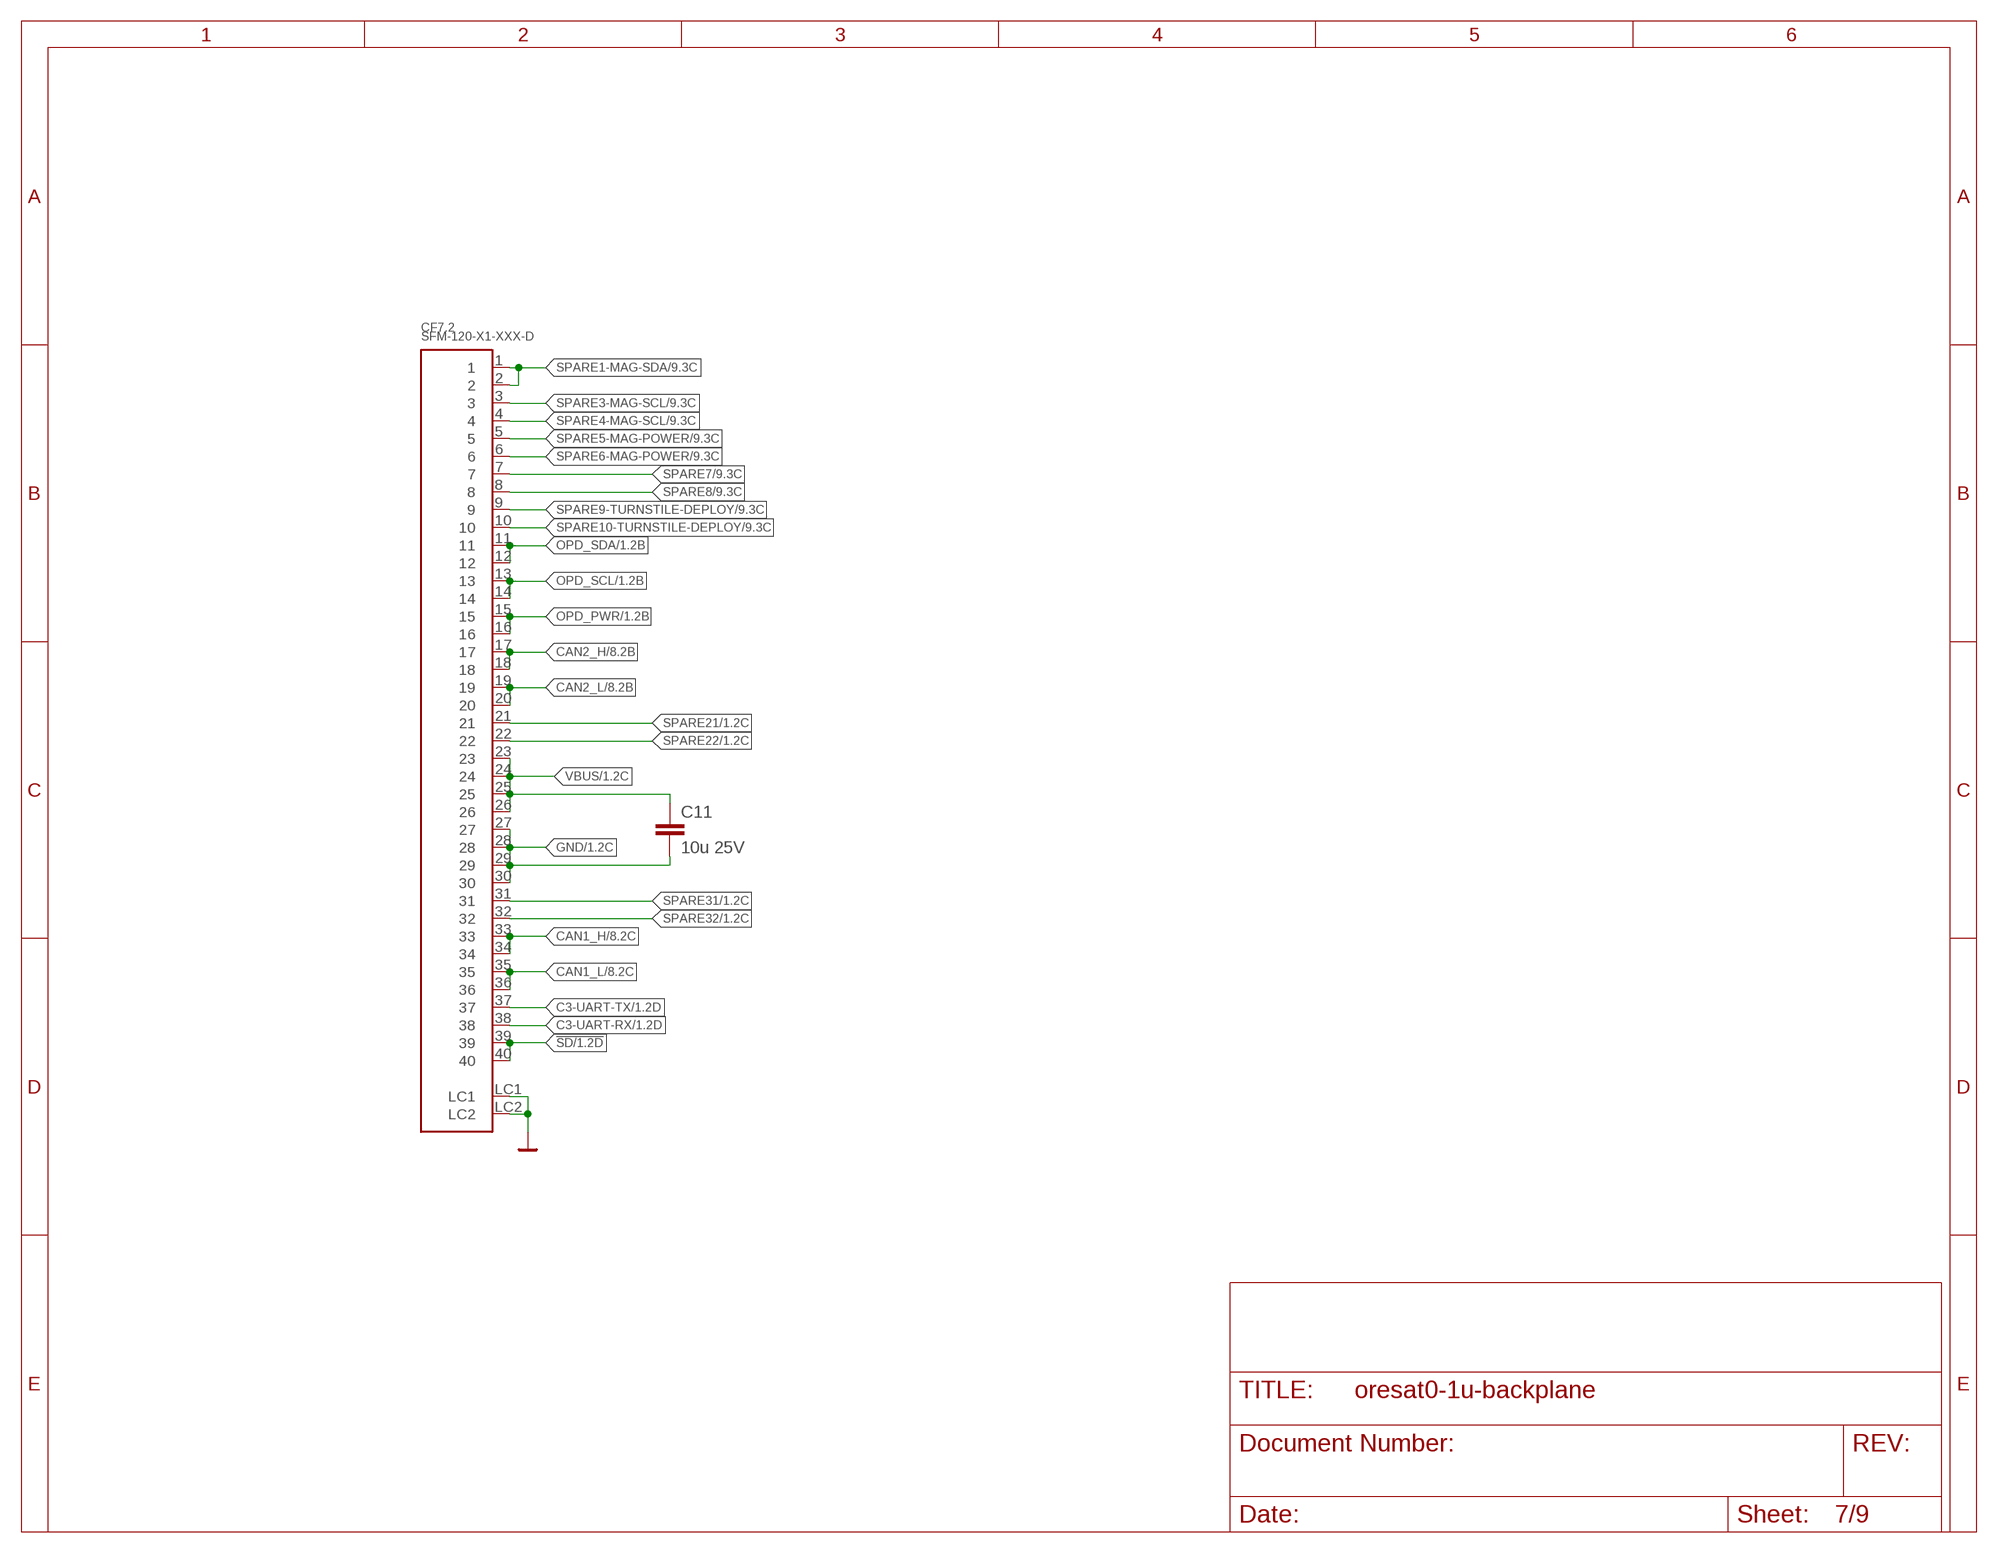
[diagram p6: schematic, sheet 7]

### Parts
C11  10u 25V  C-EU1206-B  [1206-B]
CF7.2  SFM-120-X1-XXX-D  [SFM-120-X1-XXX-D]

### Nets
!SD [SHUTDOWN]: CF7.2.39 CF7.2.40 ; also sheet 1,2,3,4,5,6
C3-UART-RX: CF7.2.38 ; also sheet 1,2,3,4,5,6
C3-UART-TX: CF7.2.37 ; also sheet 1,2,3,4,5,6
CAN1_H: CF7.2.33 CF7.2.34 ; also sheet 1,2,3,4,5,6,8
CAN1_L: CF7.2.35 CF7.2.36 ; also sheet 1,2,3,4,5,6,8
CAN2_H: CF7.2.17 CF7.2.18 ; also sheet 1,2,3,4,5,6,8
CAN2_L: CF7.2.19 CF7.2.20 ; also sheet 1,2,3,4,5,6,8
GND: C11.2 CF7.2.27 CF7.2.28 CF7.2.29 CF7.2.30 CF7.2.LC1 CF7.2.LC2 ; also sheet 1,2,3,4,5,6,8,9
OPD_PWR: CF7.2.15 CF7.2.16 ; also sheet 1,2,3,4,5,6
OPD_SCL: CF7.2.13 CF7.2.14 ; also sheet 1,2,3,4,5,6
OPD_SDA: CF7.2.11 CF7.2.12 ; also sheet 1,2,3,4,5,6
SPARE1-MAG-SDA: CF7.2.1 CF7.2.2 ; also sheet 1,2,3,4,5,6,9
SPARE3-MAG-SCL: CF7.2.3 ; also sheet 1,2,3,4,5,6,9
SPARE4-MAG-SCL: CF7.2.4 ; also sheet 1,2,3,4,5,6,9
SPARE5-MAG-POWER: CF7.2.5 ; also sheet 1,2,3,4,5,6,9
SPARE6-MAG-POWER: CF7.2.6 ; also sheet 1,2,3,4,5,6,9
SPARE7: CF7.2.7 ; also sheet 1,2,3,4,5,6,9
SPARE8: CF7.2.8 ; also sheet 1,2,3,4,5,6,9
SPARE9-TURNSTILE-DEPLOY: CF7.2.9 ; also sheet 1,2,3,4,5,6,9
SPARE10-TURNSTILE-DEPLOY: CF7.2.10 ; also sheet 1,2,3,4,5,6,9
SPARE21: CF7.2.21 ; also sheet 1,2,3,4,5,6
SPARE22: CF7.2.22 ; also sheet 1,2,3,4,5,6
SPARE31: CF7.2.31 ; also sheet 1,2,3,4,5,6
SPARE32: CF7.2.32 ; also sheet 1,2,3,4,5,6
VBUS: C11.1 CF7.2.23 CF7.2.24 CF7.2.25 CF7.2.26 ; also sheet 1,2,3,4,5,6

## Sheet 8 of 9: Slot 8
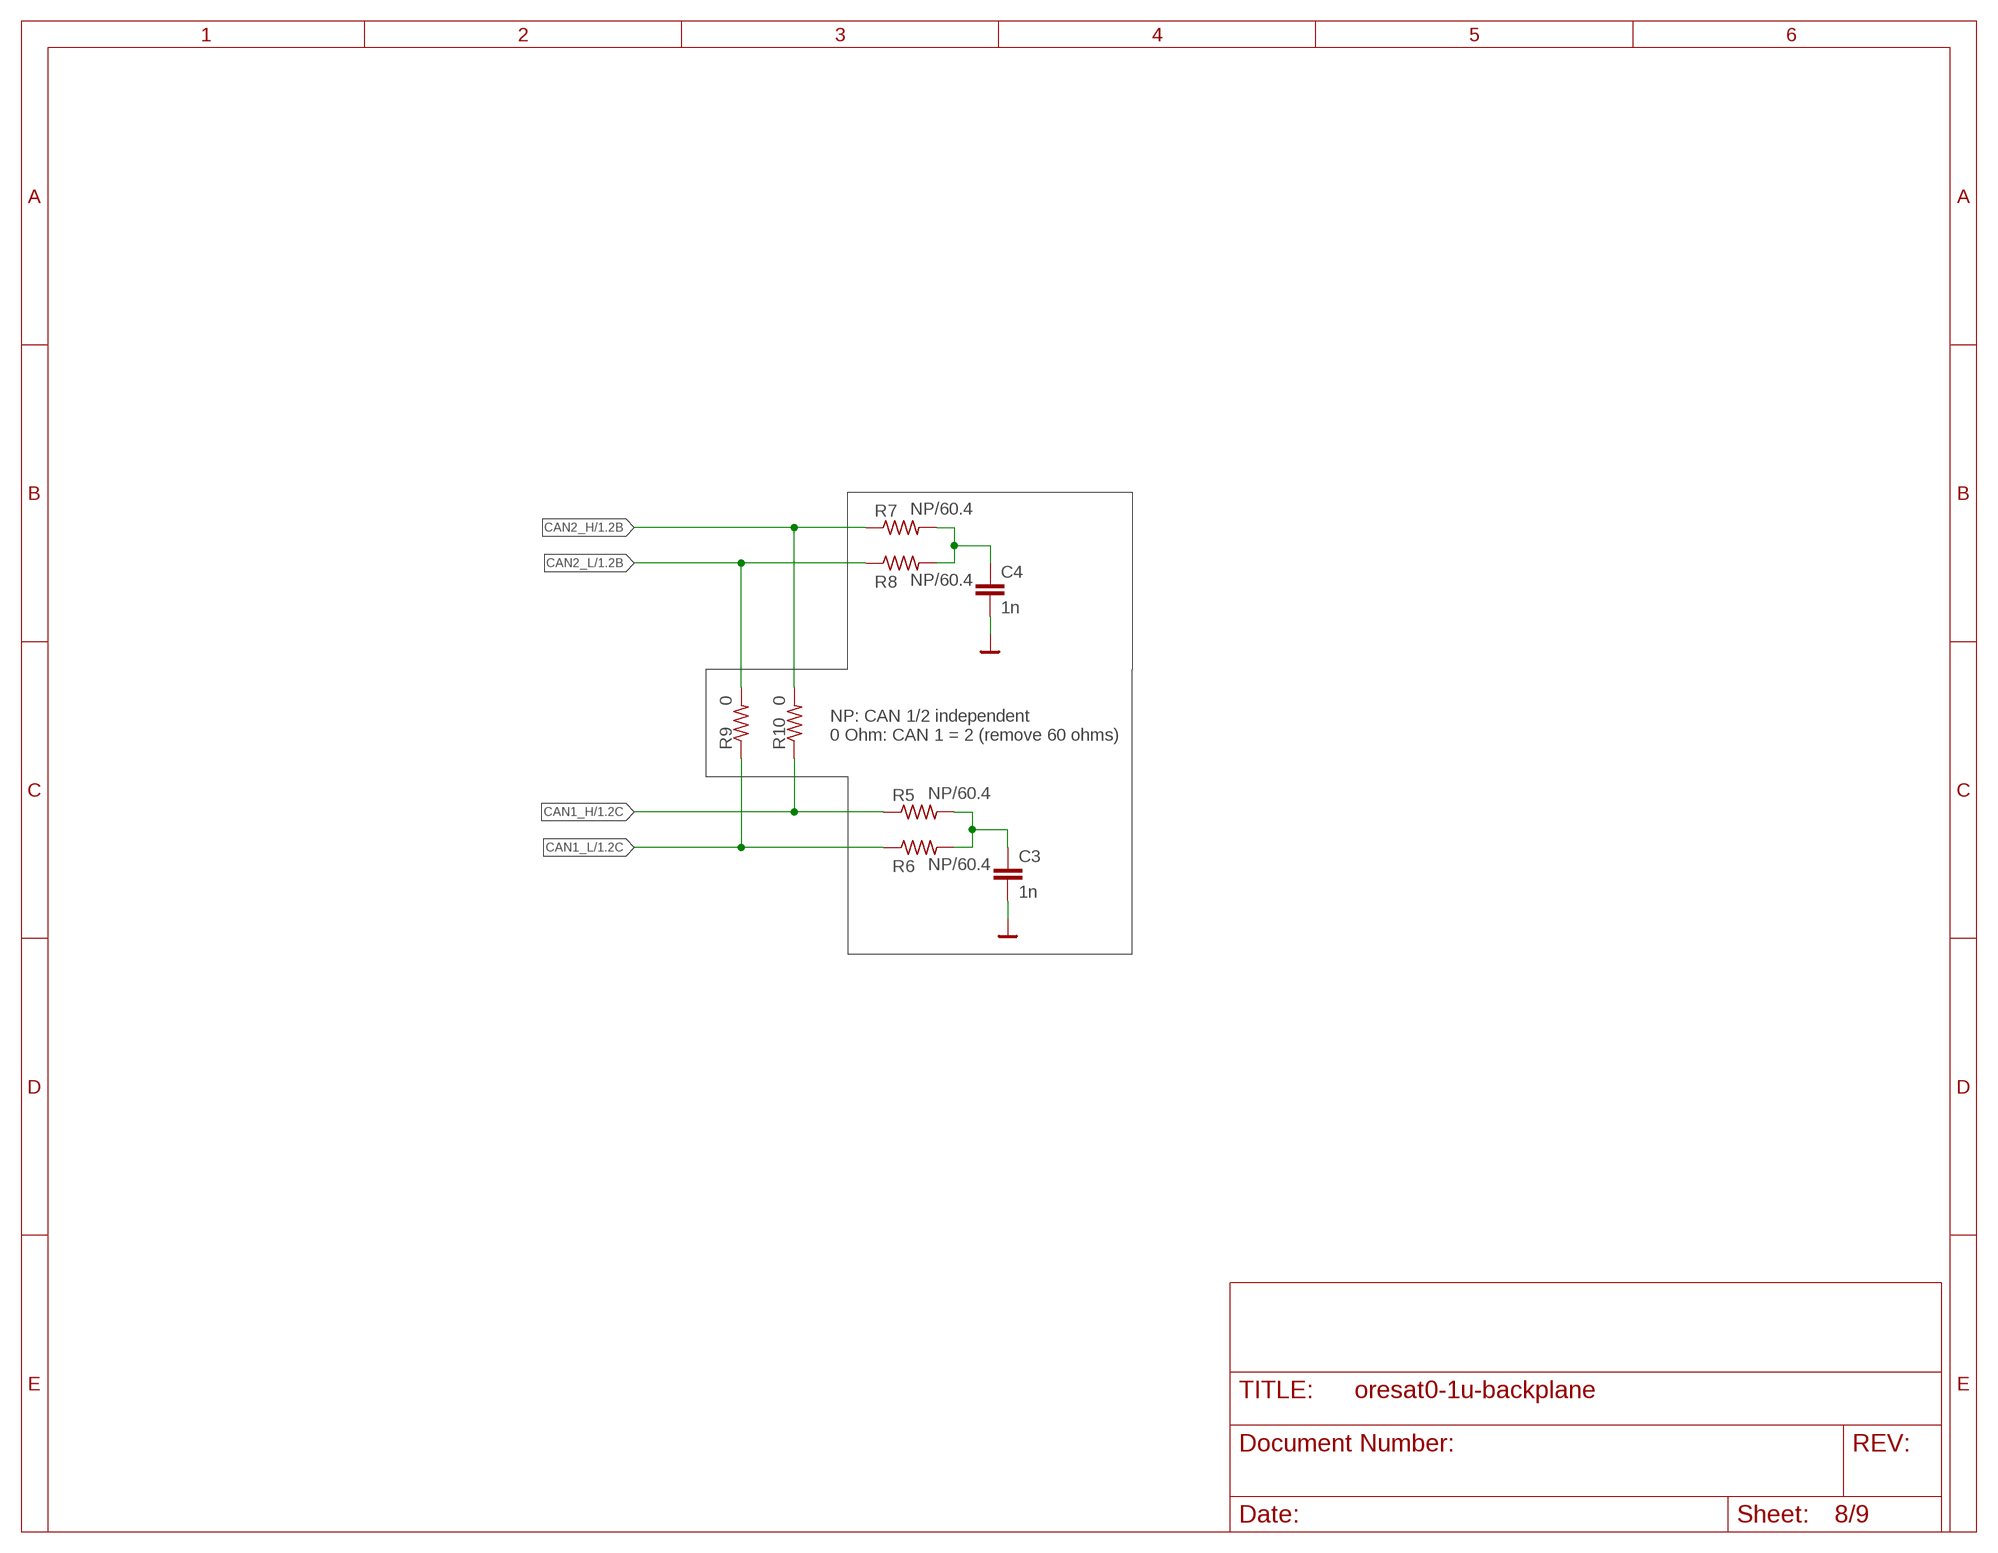
[diagram p7: schematic, sheet 8]

### Parts
C3  1n  C-EU0603-C-NOSILK  [.0603-C-NOSILK]
C4  1n  C-EU0603-C-NOSILK  [.0603-C-NOSILK]
R5  NP/60.4  R-US_1206-C  [1206-C]
R6  NP/60.4  R-US_1206-C  [1206-C]
R7  NP/60.4  R-US_1206-C  [1206-C]
R8  NP/60.4  R-US_1206-C  [1206-C]
R9  0  R-US_0603-B-NOSILK  [.0603-B-NOSILK]
R10  0  R-US_0603-B-NOSILK  [.0603-B-NOSILK]

### Nets
CAN1_H: R5.1 R10.1 ; also sheet 1,2,3,4,5,6,7
CAN1_L: R6.1 R9.1 ; also sheet 1,2,3,4,5,6,7
CAN2_H: R7.1 R10.2 ; also sheet 1,2,3,4,5,6,7
CAN2_L: R8.1 R9.2 ; also sheet 1,2,3,4,5,6,7
GND: C3.2 C4.2 ; also sheet 1,2,3,4,5,6,7,9
N$3: C4.1 R7.2 R8.2
N$4: C3.1 R5.2 R6.2

### Notes on the sheet
- NP: CAN 1/2 independent
  0 Ohm: CAN 1 = 2 (remove 60 ohms)

## Sheet 9 of 9: To -Z End Cap
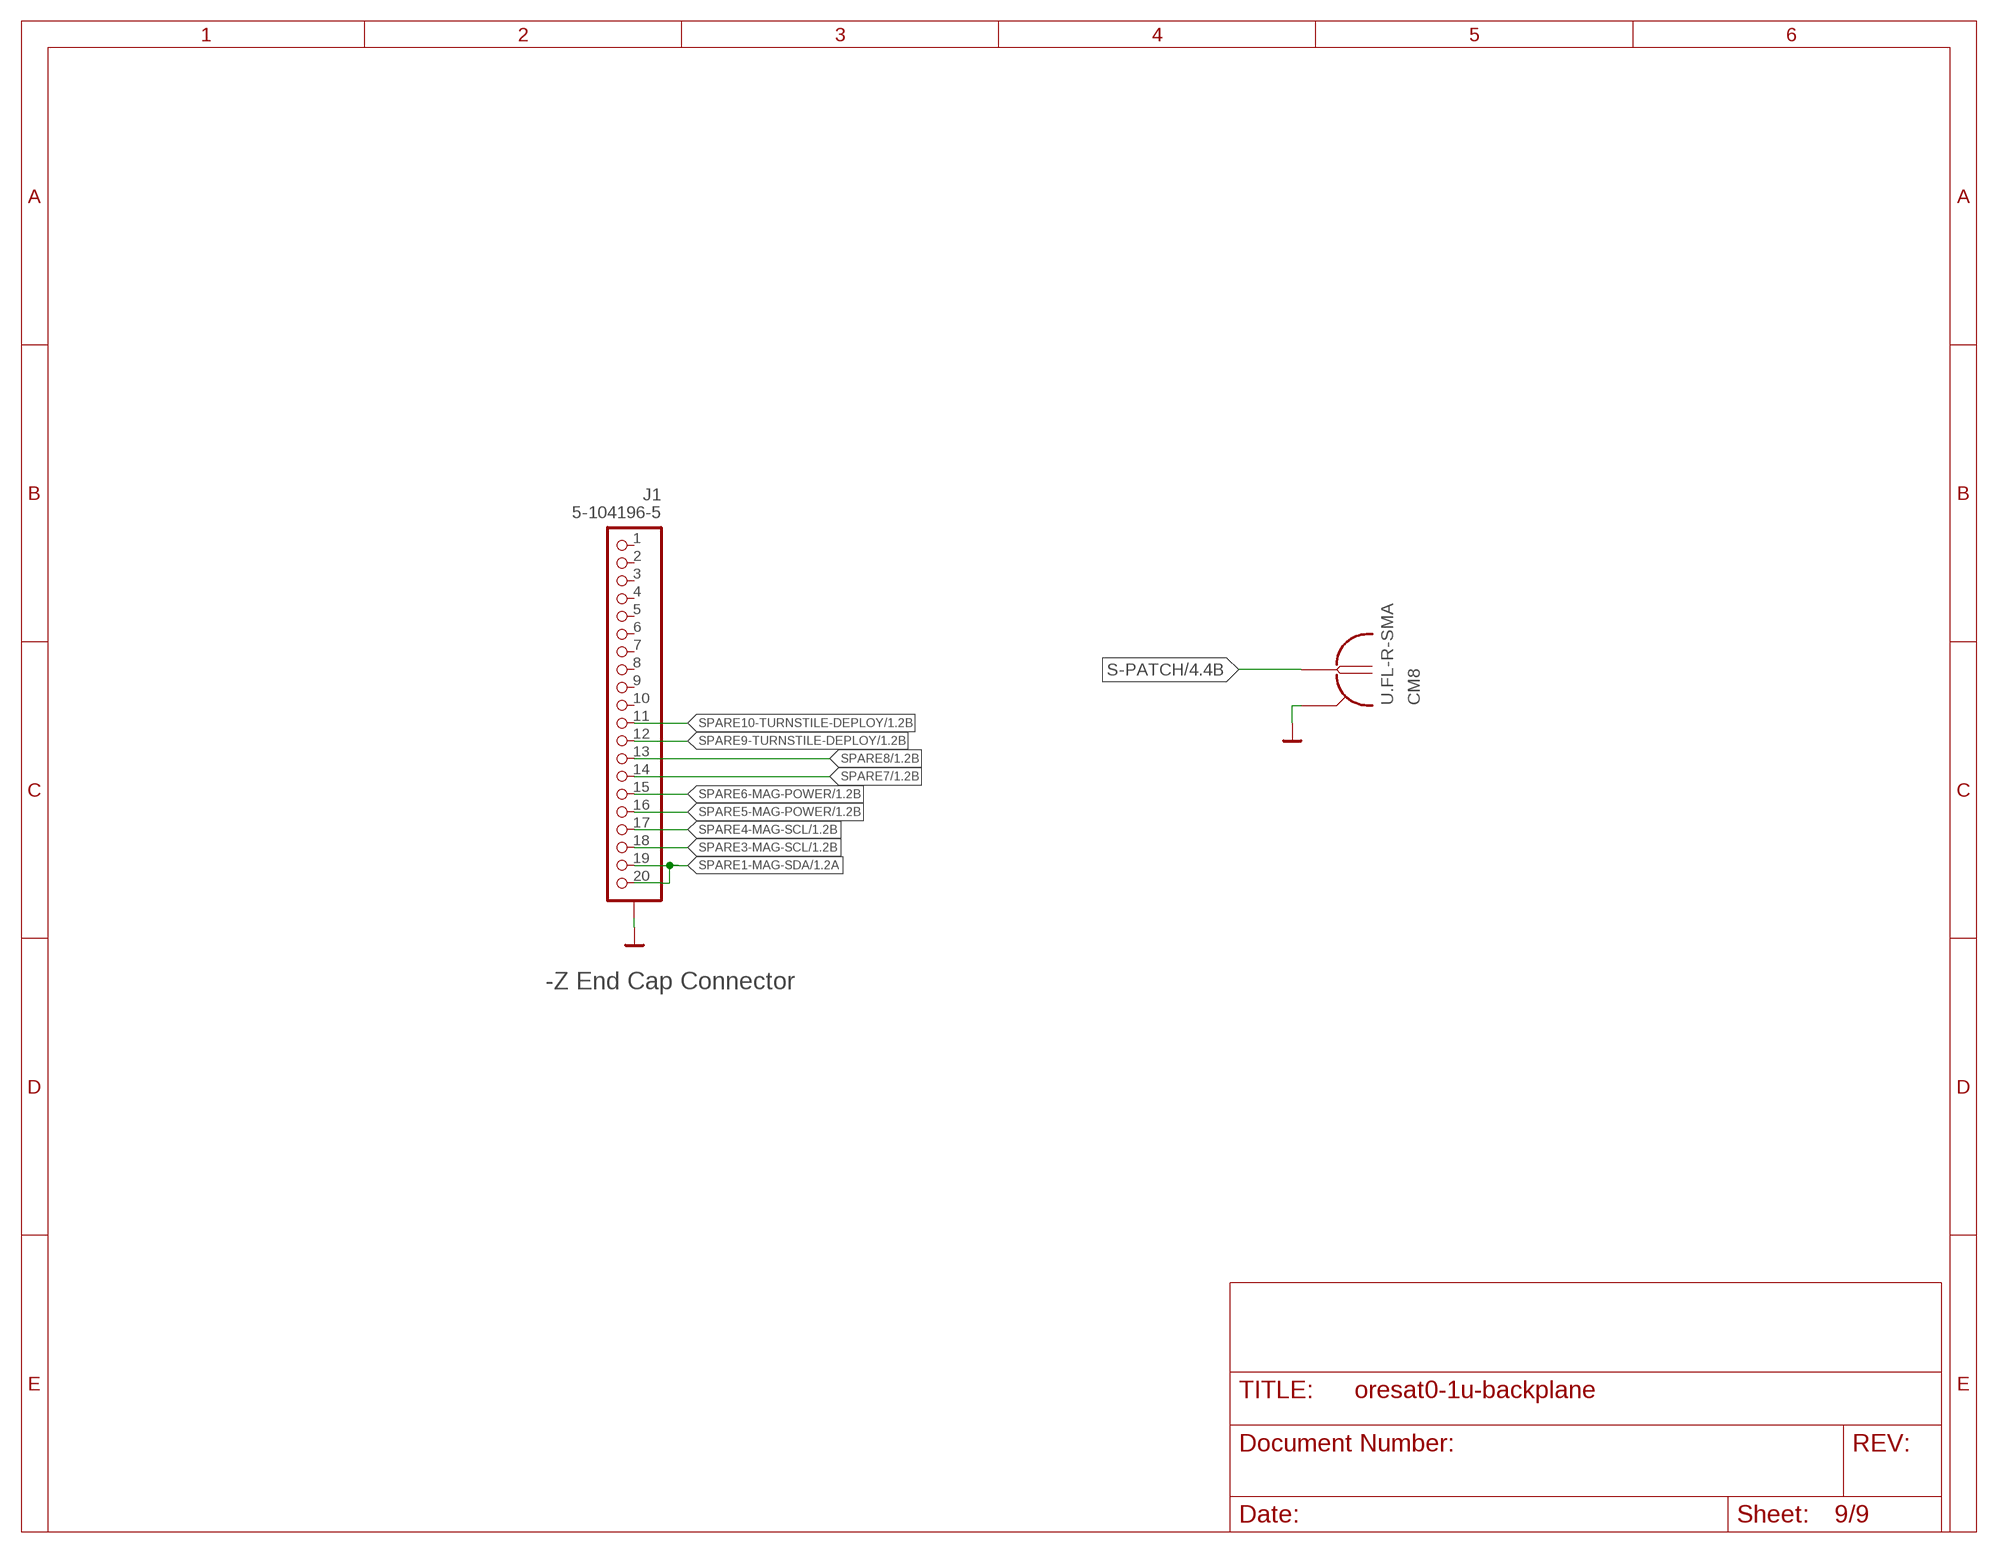
[diagram p8: schematic, sheet 9]

### Parts
CM8  U.FL-R-SMA  [U.FL-R-SMT]
J1  5-104196-5  [5-104196-5]

### Nets
GND: CM8.2 CM8.3 J1.HD1(HD) J1.HD2(HD) J1.HD3(HD) ; also sheet 1,2,3,4,5,6,7,8
S-PATCH [RF]: CM8.1 ; also sheet 4
SPARE1-MAG-SDA: J1.19 J1.20 ; also sheet 1,2,3,4,5,6,7
SPARE3-MAG-SCL: J1.18 ; also sheet 1,2,3,4,5,6,7
SPARE4-MAG-SCL: J1.17 ; also sheet 1,2,3,4,5,6,7
SPARE5-MAG-POWER: J1.16 ; also sheet 1,2,3,4,5,6,7
SPARE6-MAG-POWER: J1.15 ; also sheet 1,2,3,4,5,6,7
SPARE7: J1.14 ; also sheet 1,2,3,4,5,6,7
SPARE8: J1.13 ; also sheet 1,2,3,4,5,6,7
SPARE9-TURNSTILE-DEPLOY: J1.12 ; also sheet 1,2,3,4,5,6,7
SPARE10-TURNSTILE-DEPLOY: J1.11 ; also sheet 1,2,3,4,5,6,7
Unconnected: J1.1 J1.2 J1.3 J1.4 J1.5 J1.6 J1.7 J1.8 J1.9 J1.10

### Notes on the sheet
- -Z End Cap Connector

## Library data of the parts
C1-C11 = oresat-rcl:C-EU: CAPACITOR, European symbol
CF1.2 CF2.2 CF3.2 CF4.2 CF5.2 CF6.2 CF7.2 = J-Samtec-SFM-120-X1-XXX-D:SFM-120-X1-XXX-D: 0.05"X0.05" SOCKET STRIP DOUBLE ROW ASSEMBLY. MANUFACTURER: SAMTEC.
CM1.1-CM1.3 CM2.2 CM2.3 CM3.2 CM4.1 = J-Molex-73300-011x-SMPM-M-vertical:J-MOLEX-SMPM-73300-0111X
CM8 = J-HRS-U.FL-R-SMT-1(10)-M-RF:U.FL-R-SMA: Male SMA U.FL Connector: https://www.mouser.com/ProductDetail/Hirose-Connector/UFL-R-SMT-110?qs=kL1ClTr6oBoOdtqlGQpQrQ%3D%3D
FIDUCIAL1-FIDUCIAL3 = dock_v2:FIDUCIAL: Fiducials for optical coordinate reference
J1 = J-TE-5-104196-5-RA-1.27mm-female-th:5-104196-5
J2 = J-Harwin-M55-60X1642R-16pin-1.27mm-F-vertical:M55-6001642R; COPYRIGHT: Copyright (C) 2021 Ultra Librarian. All rights reserved.; DIGI-KEY_PART_NUMBER_1: 952-3836-2-ND; DIGI-KEY_PART_NUMBER_2: 952-3836-1-ND; DIGI-KEY_PART_NUMBER_3: 952-3836-6-ND; MANUFACTURER_PART_NUMBER: M55-6001642R; MFR_NAME: Harwin
R1-R10 = oresat-rcl:R-US_: RESISTOR, American symbol
U$1 = oresat-flight-marker:FLIGHMARKER

## Net classes
1 RF: width 0.38 mm, clearance 1 mm
2 SHUTDOWN: clearance 0.3 mm